# Altium project SJA1105Q_LAN8870_EVB_revA.PrjPcb (part 1 of 2)
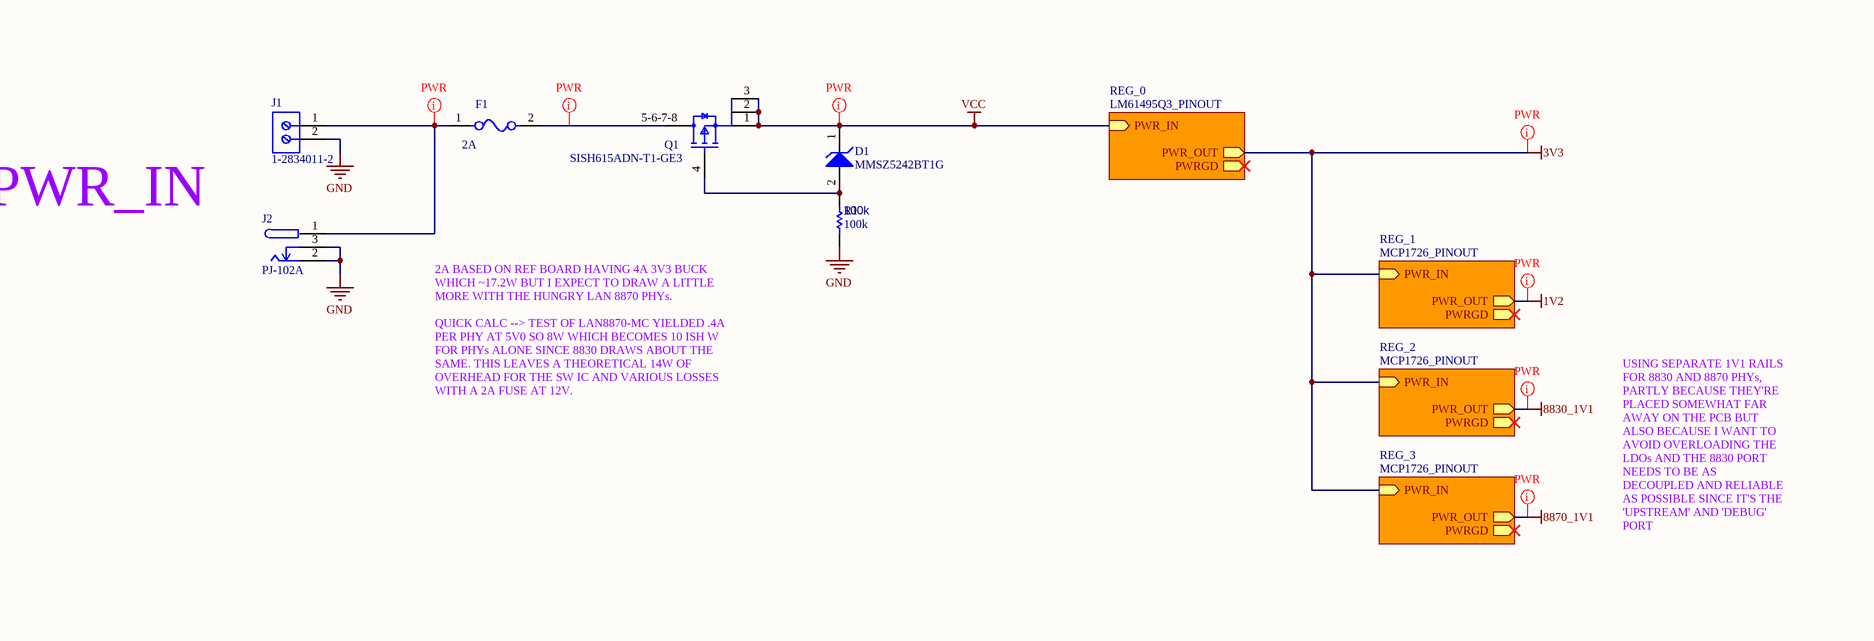
[diagram p0: SJA1105Q_LAN8870_EVB_revA.SchDoc, top left]
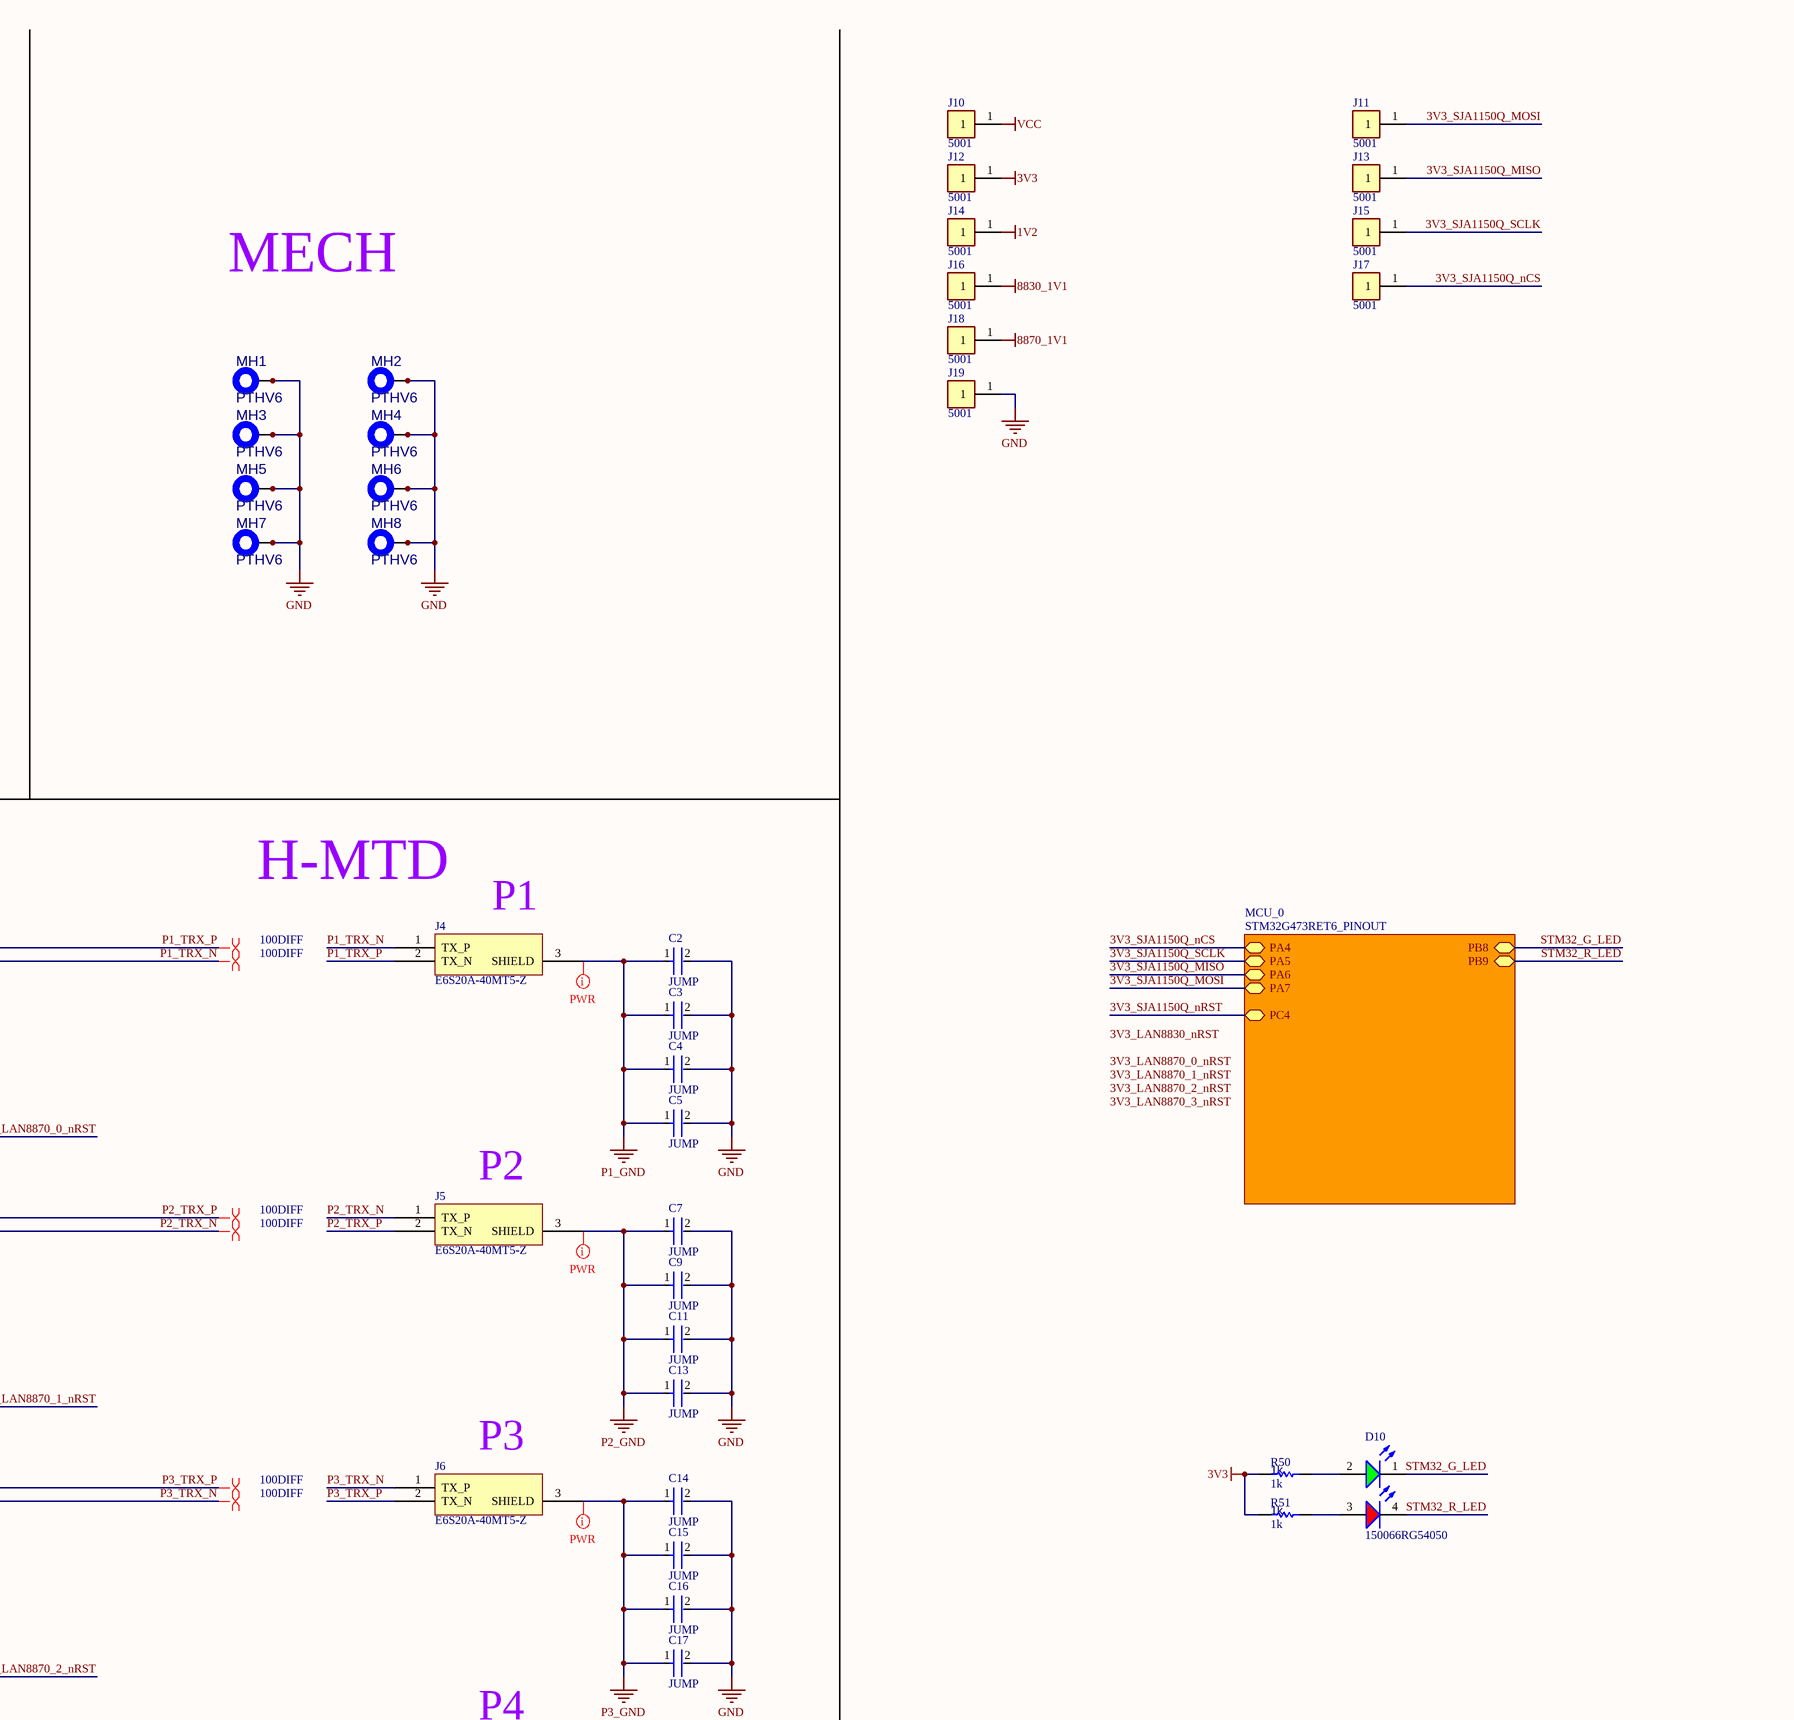
[diagram p1: SJA1105Q_LAN8870_EVB_revA.SchDoc, top right]
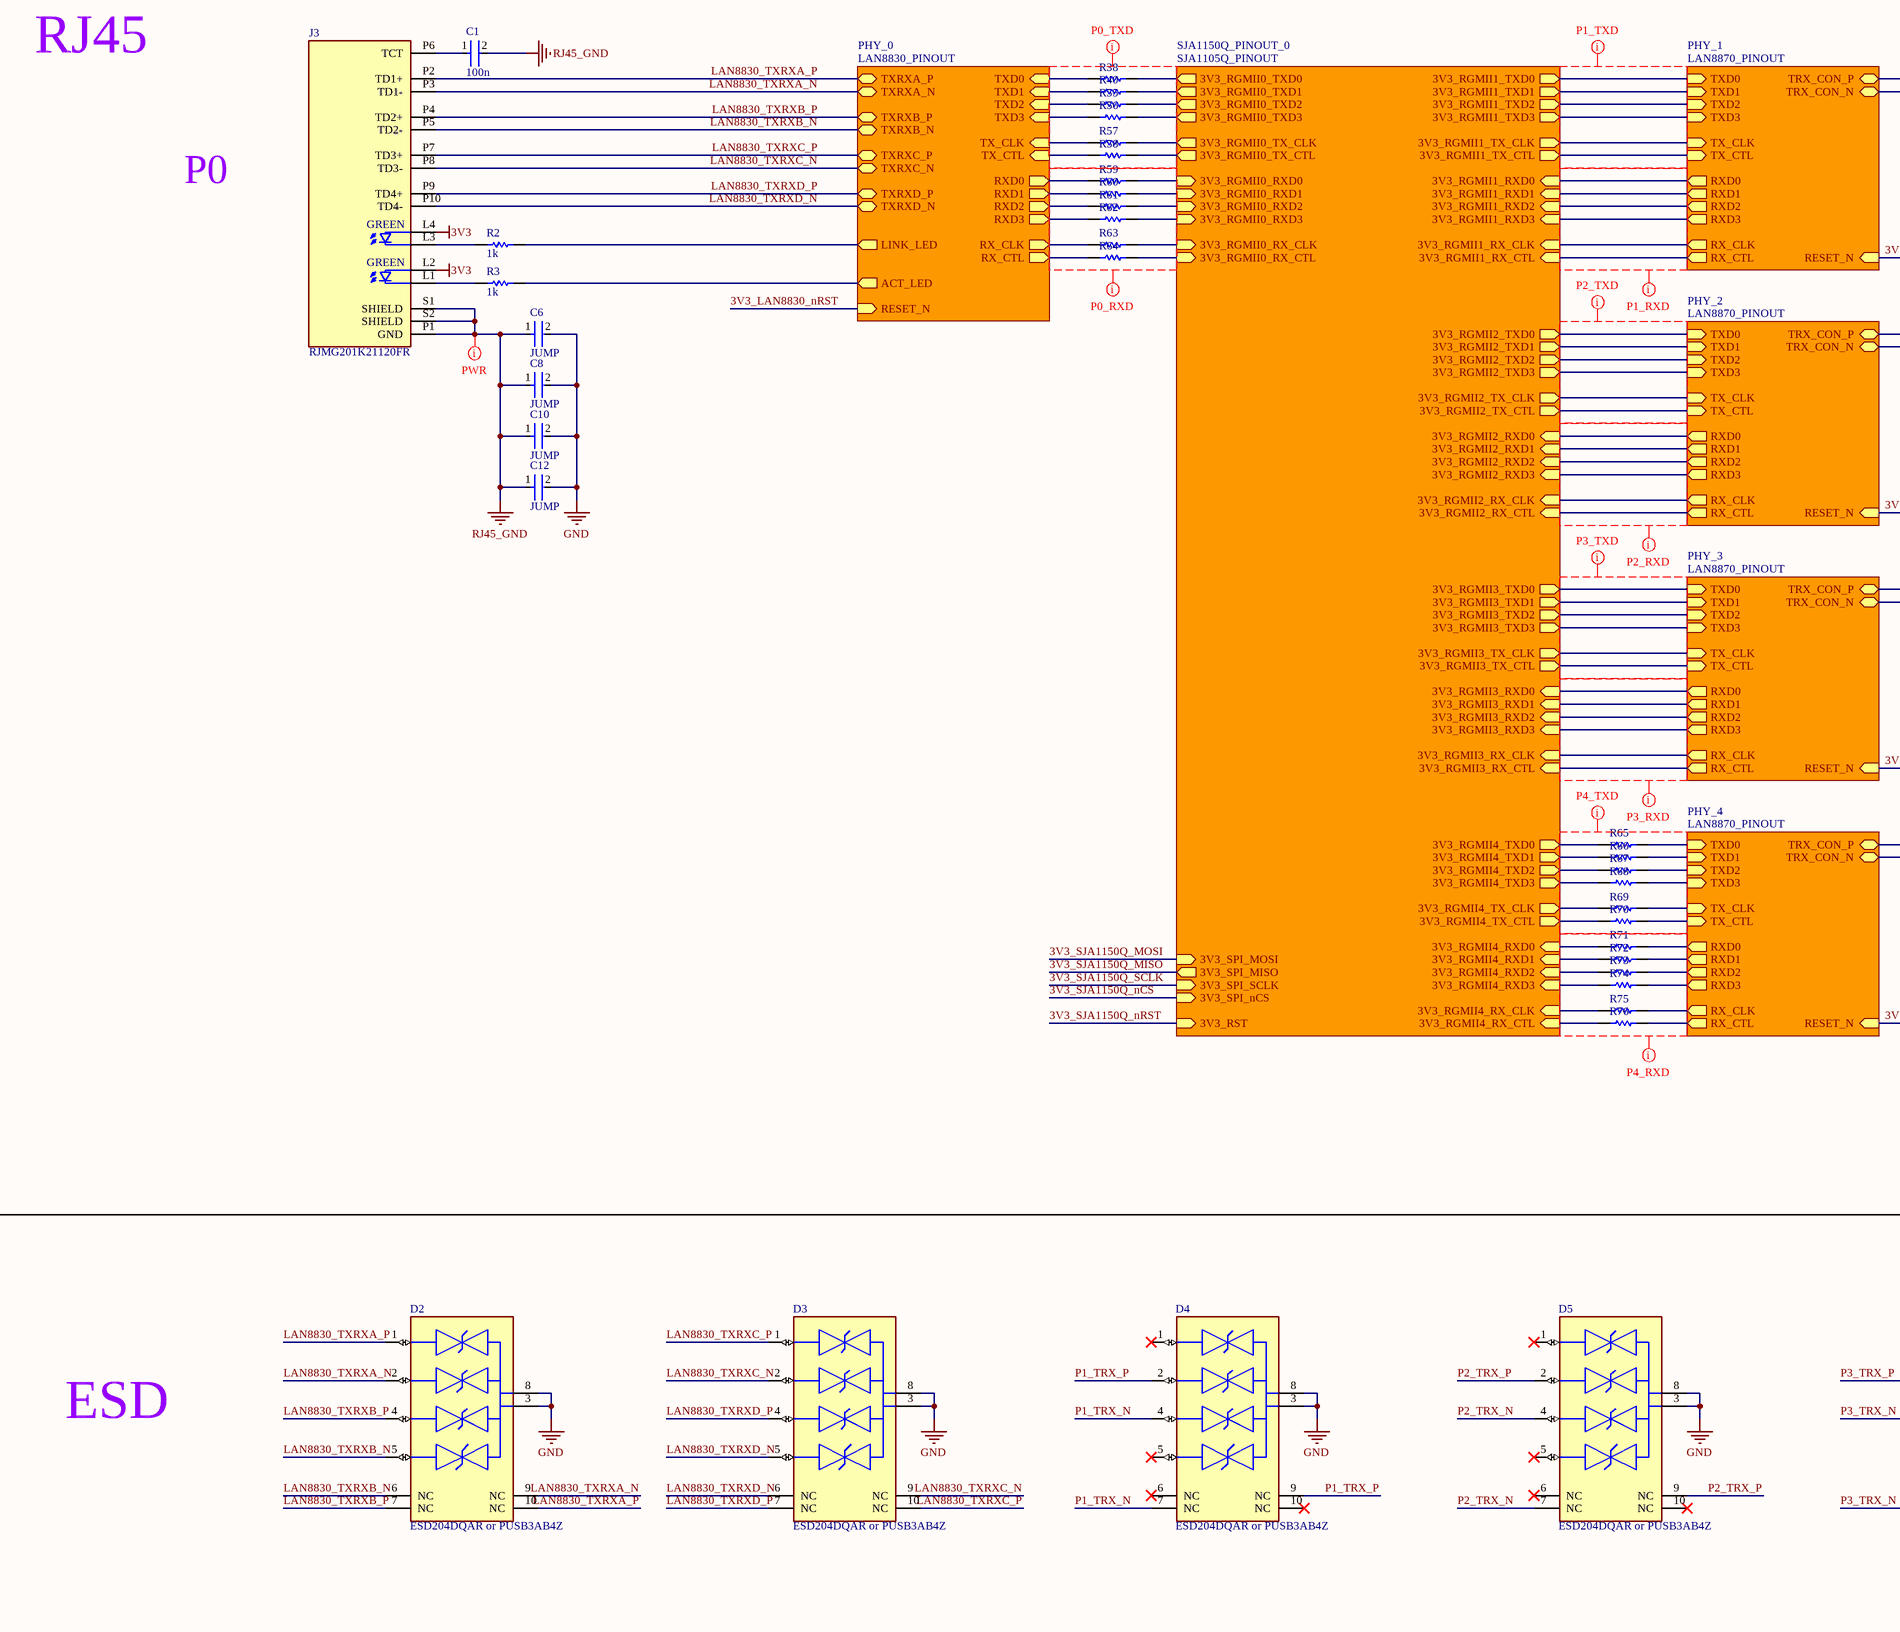
[diagram p2: SJA1105Q_LAN8870_EVB_revA.SchDoc, bottom left]
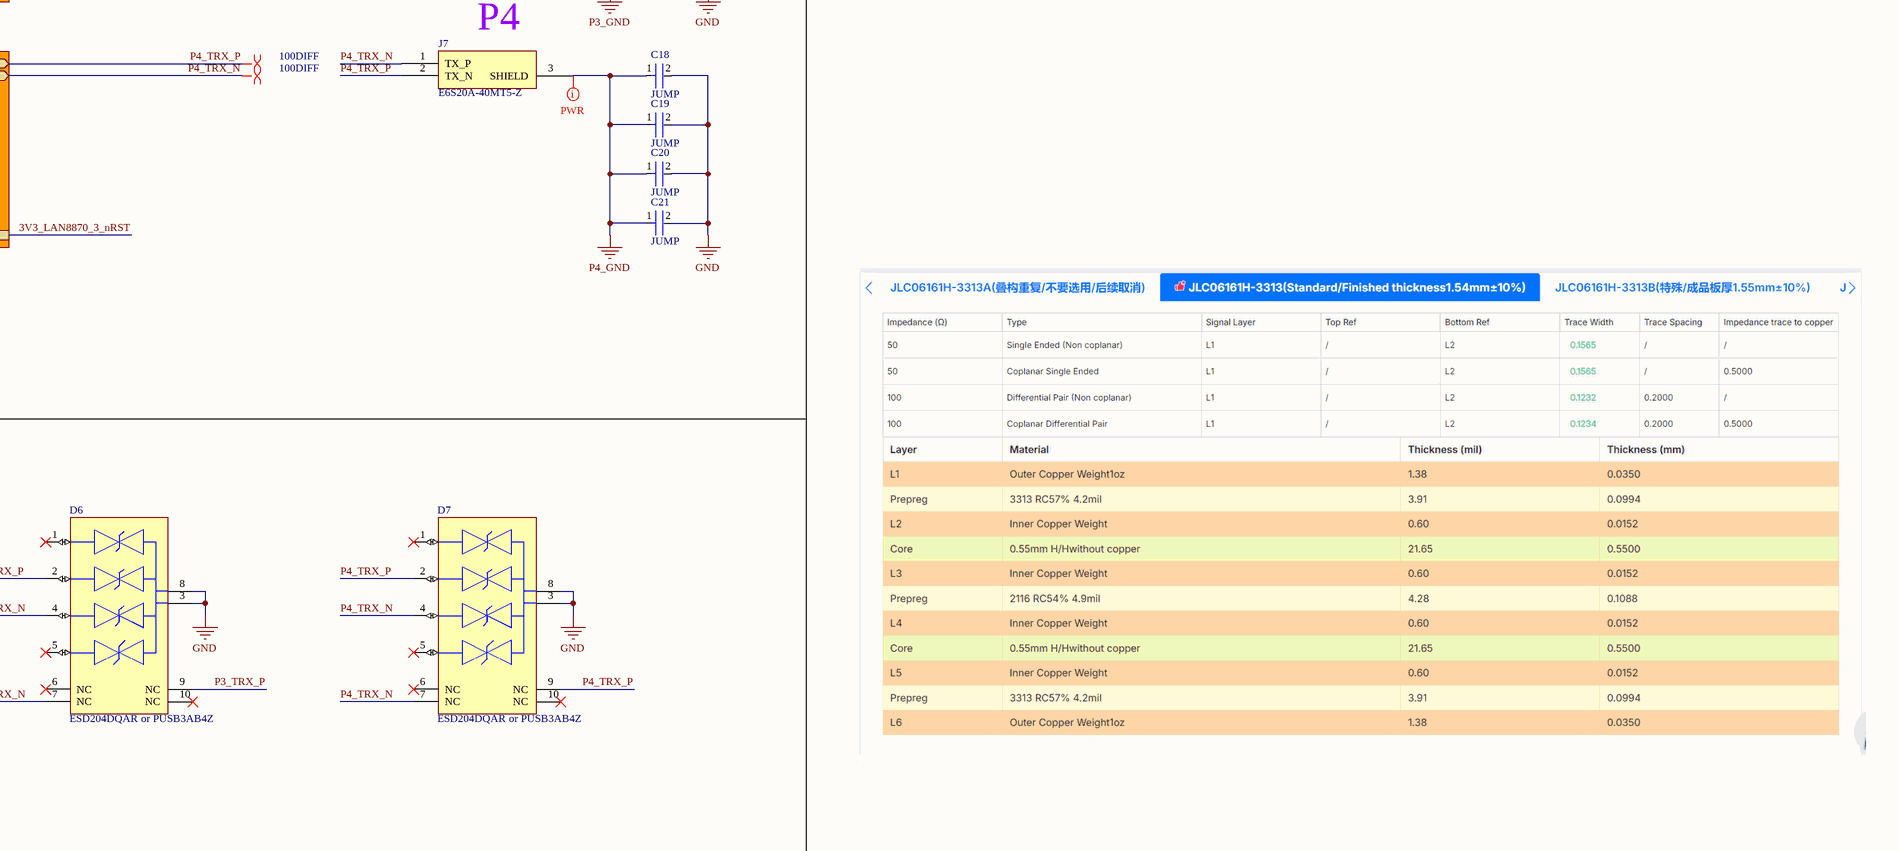
[diagram p3: SJA1105Q_LAN8870_EVB_revA.SchDoc, bottom right]
7 sheets, 490 parts. Net scope: hierarchical (ports join the sheet entries above them; power ports are global).
Board file: SJA1105Q_LAN8870_EVB_revA.PcbDoc
Sheets:
  SJA1105Q_LAN8870_EVB_revA.SchDoc
    SJA1150Q_PINOUT_0 = SJA1105Q_PINOUT.SchDoc
    PHY_1 = LAN8870_PINOUT.SchDoc
    PHY_0 = LAN8830_PINOUT.SchDoc
    PHY_2 = LAN8870_PINOUT.SchDoc
    PHY_3 = LAN8870_PINOUT.SchDoc
    PHY_4 = LAN8870_PINOUT.SchDoc
    REG_0 = LM61495Q3_PINOUT.SchDoc
    REG_1 = MCP1726_PINOUT.SchDoc
    REG_2 = MCP1726_PINOUT.SchDoc
    MCU_0 = STM32G473RET6_PINOUT.SchDoc
    REG_3 = MCP1726_PINOUT.SchDoc

## Sheet SJA1105Q_LAN8870_EVB_revA.SchDoc
size D; SheetNumber: 1; SheetTotal: 7

### Parts
C1  100n  [FP-0402-L_1_0_0_05-W_0_5-IPC_A]
C2  JUMP  [FP-0402-L_1_0_0_05-W_0_5-IPC_A]
C3  JUMP  [FP-0402-L_1_0_0_05-W_0_5-IPC_A]
C4  JUMP  [FP-0402-L_1_0_0_05-W_0_5-IPC_A]
C5  JUMP  [FP-0402-L_1_0_0_05-W_0_5-IPC_A]
C6  JUMP  [FP-0402-L_1_0_0_05-W_0_5-IPC_A]
C7  JUMP  [FP-0402-L_1_0_0_05-W_0_5-IPC_A]
C8  JUMP  [FP-0402-L_1_0_0_05-W_0_5-IPC_A]
C9  JUMP  [FP-0402-L_1_0_0_05-W_0_5-IPC_A]
C10  JUMP  [FP-0402-L_1_0_0_05-W_0_5-IPC_A]
C11  JUMP  [FP-0402-L_1_0_0_05-W_0_5-IPC_A]
C12  JUMP  [FP-0402-L_1_0_0_05-W_0_5-IPC_A]
C13  JUMP  [FP-0402-L_1_0_0_05-W_0_5-IPC_A]
C14  JUMP  [FP-0402-L_1_0_0_05-W_0_5-IPC_A]
C15  JUMP  [FP-0402-L_1_0_0_05-W_0_5-IPC_A]
C16  JUMP  [FP-0402-L_1_0_0_05-W_0_5-IPC_A]
C17  JUMP  [FP-0402-L_1_0_0_05-W_0_5-IPC_A]
C18  JUMP  [FP-0402-L_1_0_0_05-W_0_5-IPC_A]
C19  JUMP  [FP-0402-L_1_0_0_05-W_0_5-IPC_A]
C20  JUMP  [FP-0402-L_1_0_0_05-W_0_5-IPC_A]
C21  JUMP  [FP-0402-L_1_0_0_05-W_0_5-IPC_A]
D1  MMSZ5242BT1G  [ONSC-SOD-123-2-425-04_V]
D2  ESD204DQAR or PUSB3AB4Z  [FP-DQA0010A-MFG]
D3  ESD204DQAR or PUSB3AB4Z  [FP-DQA0010A-MFG]
D4  ESD204DQAR or PUSB3AB4Z  [FP-DQA0010A-MFG]
D5  ESD204DQAR or PUSB3AB4Z  [FP-DQA0010A-MFG]
D6  ESD204DQAR or PUSB3AB4Z  [FP-DQA0010A-MFG]
D7  ESD204DQAR or PUSB3AB4Z  [FP-DQA0010A-MFG]
D10  150066RG54050  [WL-SBCD_0606]
F1  2A  [FP-SF-1206FP-MFG]
J1  1-2834011-2  [1-2834011-2-Footprint-1]
J2  PJ-102A  [FP-PJ-102A-MFG]
J3  RJMG201K21120FR  [RJMG201K21120FR-Footprint-1]
J4  E6S20A-40MT5-Z  [E6S20A-40MT5-Z-Footprint-1]
J5  E6S20A-40MT5-Z  [E6S20A-40MT5-Z-Footprint-1]
J6  E6S20A-40MT5-Z  [E6S20A-40MT5-Z-Footprint-1]
J7  E6S20A-40MT5-Z  [E6S20A-40MT5-Z-Footprint-1]
J10  5001  [FP-5001-MFG]
J11  5001  [FP-5001-MFG]
J12  5001  [FP-5001-MFG]
J13  5001  [FP-5001-MFG]
J14  5001  [FP-5001-MFG]
J15  5001  [FP-5001-MFG]
J16  5001  [FP-5001-MFG]
J17  5001  [FP-5001-MFG]
J18  5001  [FP-5001-MFG]
J19  5001  [FP-5001-MFG]
MH1  PTHV6  [PTHV6 M2]  (net tie, no BOM)
MH2  PTHV6  [PTHV6 M2]  (net tie, no BOM)
MH3  PTHV6  [PTHV6 M2]  (net tie, no BOM)
MH4  PTHV6  [PTHV6 M2]  (net tie, no BOM)
MH5  PTHV6  [PTHV6 M2]  (net tie, no BOM)
MH6  PTHV6  [PTHV6 M2]  (net tie, no BOM)
MH7  PTHV6  [PTHV6 M2]  (net tie, no BOM)
MH8  PTHV6  [PTHV6 M2]  (net tie, no BOM)
Q1  SISH615ADN-T1-GE3  [SISH615ADN-T1-GE3-Footprint-1]
R1  100k  [R0603B]
R2  1k  [R0603B]
R3  1k  [R0603B]
R38  0402 JUMPER  [RESC1005X40X25ML05T05]  (value not drawn)
R40  0402 JUMPER  [RESC1005X40X25ML05T05]  (value not drawn)
R50  1k  [R0603B]
R51  1k  [R0603B]
R55  0402 JUMPER  [RESC1005X40X25ML05T05]  (value not drawn)
R56  0402 JUMPER  [RESC1005X40X25ML05T05]  (value not drawn)
R57  0402 JUMPER  [RESC1005X40X25ML05T05]  (value not drawn)
R58  0402 JUMPER  [RESC1005X40X25ML05T05]  (value not drawn)
R59  0402 JUMPER  [RESC1005X40X25ML05T05]  (value not drawn)
R60  0402 JUMPER  [RESC1005X40X25ML05T05]  (value not drawn)
R61  0402 JUMPER  [RESC1005X40X25ML05T05]  (value not drawn)
R62  0402 JUMPER  [RESC1005X40X25ML05T05]  (value not drawn)
R63  0402 JUMPER  [RESC1005X40X25ML05T05]  (value not drawn)
R64  0402 JUMPER  [RESC1005X40X25ML05T05]  (value not drawn)
R65  0402 JUMPER  [RESC1005X40X25ML05T05]  (value not drawn)
R66  0402 JUMPER  [RESC1005X40X25ML05T05]  (value not drawn)
R67  0402 JUMPER  [RESC1005X40X25ML05T05]  (value not drawn)
R68  0402 JUMPER  [RESC1005X40X25ML05T05]  (value not drawn)
R69  0402 JUMPER  [RESC1005X40X25ML05T05]  (value not drawn)
R70  0402 JUMPER  [RESC1005X40X25ML05T05]  (value not drawn)
R71  0402 JUMPER  [RESC1005X40X25ML05T05]  (value not drawn)
R72  0402 JUMPER  [RESC1005X40X25ML05T05]  (value not drawn)
R73  0402 JUMPER  [RESC1005X40X25ML05T05]  (value not drawn)
R74  0402 JUMPER  [RESC1005X40X25ML05T05]  (value not drawn)
R75  0402 JUMPER  [RESC1005X40X25ML05T05]  (value not drawn)
R76  0402 JUMPER  [RESC1005X40X25ML05T05]  (value not drawn)

### Sub-sheets
MCU_0 = STM32G473RET6_PINOUT: PA5 (bidir), PA6 (bidir), PA7 (bidir), PA4 (bidir), PC4 (bidir), PB9 (bidir), PB8 (bidir)
PHY_0 = LAN8830_PINOUT: TXD0 (in), TXD1 (in), TXD2 (in), TXD3 (in), TX_CTL (in), RXD0 (out), RXD1 (out), RXD2 (out), RXD3 (out), RX_CTL (out), TXRXA_P (bidir), TXRXA_N (bidir), ACT_LED (out), LINK_LED (out), RESET_N (in), TXRXB_P (bidir), TXRXB_N (bidir), TXRXC_P (bidir), TXRXC_N (bidir), TXRXD_P (bidir), TXRXD_N (bidir), TX_CLK (in), RX_CLK (out)
PHY_1 = LAN8870_PINOUT: TRX_CON_P (bidir), TRX_CON_N (bidir), RESET_N (in), TXD0 (in), TXD1 (in), TXD2 (in), TXD3 (in), TX_CTL (in), RXD0 (out), RXD1 (out), RXD2 (out), RXD3 (out), RX_CTL (out), TX_CLK (in), RX_CLK (out)
PHY_2 = LAN8870_PINOUT: TRX_CON_P (bidir), TRX_CON_N (bidir), RESET_N (in), TXD0 (in), TXD1 (in), TXD2 (in), TXD3 (in), TX_CTL (in), RXD0 (out), RXD1 (out), RXD2 (out), RXD3 (out), RX_CTL (out), TX_CLK (in), RX_CLK (out)
PHY_3 = LAN8870_PINOUT: TRX_CON_P (bidir), TRX_CON_N (bidir), RESET_N (in), TXD0 (in), TXD1 (in), TXD2 (in), TXD3 (in), TX_CTL (in), RXD0 (out), RXD1 (out), RXD2 (out), RXD3 (out), RX_CTL (out), TX_CLK (in), RX_CLK (out)
PHY_4 = LAN8870_PINOUT: TRX_CON_P (bidir), TRX_CON_N (bidir), RESET_N (in), TXD0 (in), TXD1 (in), TXD2 (in), TXD3 (in), TX_CTL (in), RXD0 (out), RXD1 (out), RXD2 (out), RXD3 (out), RX_CTL (out), TX_CLK (in), RX_CLK (out)
REG_0 = LM61495Q3_PINOUT: PWR_IN (in), PWR_OUT (out), PWRGD (out)
REG_1 = MCP1726_PINOUT: PWR_OUT (out), PWR_IN (in), PWRGD (out)
REG_2 = MCP1726_PINOUT: PWR_OUT (out), PWR_IN (in), PWRGD (out)
REG_3 = MCP1726_PINOUT: PWR_OUT (out), PWR_IN (in), PWRGD (out)
SJA1150Q_PINOUT_0 = SJA1105Q_PINOUT: 3V3_RGMII0_TXD0 (out), 3V3_RGMII0_TXD1 (out), 3V3_RGMII0_TXD2 (out), 3V3_RGMII0_TXD3 (out), 3V3_RGMII0_TX_CLK (out), 3V3_RGMII0_TX_CTL (out), 3V3_RGMII0_RXD0 (in), 3V3_RGMII0_RXD1 (in), 3V3_RGMII0_RXD2 (in), 3V3_RGMII0_RXD3 (in), 3V3_RGMII0_RX_CLK (in), 3V3_RGMII0_RX_CTL (in), 3V3_RGMII1_TXD0 (out), 3V3_RGMII1_TXD1 (out), 3V3_RGMII1_TXD2 (out), 3V3_RGMII1_TXD3 (out), 3V3_RGMII1_TX_CLK (out), 3V3_RGMII1_TX_CTL (out), 3V3_RGMII1_RXD0 (in), 3V3_RGMII1_RXD1 (in), 3V3_RGMII1_RXD2 (in), 3V3_RGMII1_RXD3 (in), 3V3_RGMII1_RX_CLK (in), 3V3_RGMII1_RX_CTL (in), 3V3_RGMII2_TXD0 (out), 3V3_RGMII2_TXD1 (out), 3V3_RGMII2_TXD2 (out), 3V3_RGMII2_TXD3 (out), 3V3_RGMII2_TX_CLK (out), 3V3_RGMII2_TX_CTL (out), 3V3_RGMII2_RXD0 (in), 3V3_RGMII2_RXD1 (in), 3V3_RGMII2_RXD2 (in), 3V3_RGMII2_RXD3 (in), 3V3_RGMII2_RX_CLK (in), 3V3_RGMII2_RX_CTL (in), 3V3_RGMII3_TXD0 (out), 3V3_RGMII3_TXD1 (out), 3V3_RGMII3_TXD2 (out), 3V3_RGMII3_TXD3 (out), 3V3_RGMII3_TX_CLK (out), 3V3_RGMII3_TX_CTL (out), 3V3_RGMII3_RXD0 (in), 3V3_RGMII3_RXD1 (in), 3V3_RGMII3_RXD2 (in), 3V3_RGMII3_RXD3 (in), 3V3_RGMII3_RX_CLK (in), 3V3_RGMII3_RX_CTL (in), 3V3_RGMII4_TXD0 (out), 3V3_RGMII4_TXD1 (out), 3V3_RGMII4_TXD2 (out), 3V3_RGMII4_TXD3 (out), 3V3_RGMII4_TX_CLK (out), 3V3_RGMII4_TX_CTL (out), 3V3_RGMII4_RXD0 (in), 3V3_RGMII4_RXD1 (in), 3V3_RGMII4_RXD2 (in), 3V3_RGMII4_RXD3 (in), 3V3_RGMII4_RX_CLK (in), 3V3_RGMII4_RX_CTL (in), 3V3_RST (in), 3V3_SPI_MOSI (in), 3V3_SPI_MISO (out), 3V3_SPI_SCLK (in), 3V3_SPI_nCS (in)

### Nets
1V2: J14.1 ; sheet REG_1/PWR_OUT
3V3: J3.L2 J3.L4 J12.1 R50.2 R51.2 ; sheet REG_0/PWR_OUT, sheet REG_1/PWR_IN, sheet REG_2/PWR_IN, sheet REG_3/PWR_IN
8830_1V1: J16.1 ; sheet REG_2/PWR_OUT
8870_1V1: J18.1 ; sheet REG_3/PWR_OUT
GND: C2.2 C3.2 C4.2 C5.2 C6.2 C7.2 C8.2 C9.2 C10.2 C11.2 C12.2 C13.2 C14.2 C15.2 C16.2 C17.2 C18.2 C19.2 C20.2 C21.2 D2.3(GND) D2.8(GND) D3.3(GND) D3.8(GND) D4.3(GND) D4.8(GND) D5.3(GND) D5.8(GND) D6.3(GND) D6.8(GND) D7.3(GND) D7.8(GND) J1.2 J2.2 J2.3 J19.1 MH1.1(MH) MH1.2(V1) MH1.3(V2) MH1.4(V3) MH1.5(V4) MH1.6(V5) MH1.7(V6) MH2.1(MH) MH2.2(V1) MH2.3(V2) MH2.4(V3) MH2.5(V4) MH2.6(V5) MH2.7(V6) MH3.1(MH) MH3.2(V1) MH3.3(V2) MH3.4(V3) MH3.5(V4) MH3.6(V5) MH3.7(V6) MH4.1(MH) MH4.2(V1) MH4.3(V2) MH4.4(V3) MH4.5(V4) MH4.6(V5) MH4.7(V6) MH5.1(MH) MH5.2(V1) MH5.3(V2) MH5.4(V3) MH5.5(V4) MH5.6(V5) MH5.7(V6) MH6.1(MH) MH6.2(V1) MH6.3(V2) MH6.4(V3) MH6.5(V4) MH6.6(V5) MH6.7(V6) MH7.1(MH) MH7.2(V1) MH7.3(V2) MH7.4(V3) MH7.5(V4) MH7.6(V5) MH7.7(V6) MH8.1(MH) MH8.2(V1) MH8.3(V2) MH8.4(V3) MH8.5(V4) MH8.6(V5) MH8.7(V6) R1.1
P1_GND: C2.1 C3.1 C4.1 C5.1 J4.3(SHIELD)
P2_GND: C7.1 C9.1 C11.1 C13.1 J5.3(SHIELD)
P3_GND: C14.1 C15.1 C16.1 C17.1 J6.3(SHIELD)
P4_GND: C18.1 C19.1 C20.1 C21.1 J7.3(SHIELD)
RJ45_GND: C1.2 C6.1 C8.1 C10.1 C12.1 J3.P1(GND) J3.S1(SHIELD) J3.S2(SHIELD)
VCC: D1.1(K) J10.1 Q1.1(S) Q1.2(S) Q1.3(S) ; sheet REG_0/PWR_IN
3V3_SJA1150Q_MISO: J13.1 ; sheet SJA1150Q_PINOUT_0/3V3_SPI_MISO, sheet MCU_0/PA6
3V3_SJA1150Q_MOSI: J11.1 ; sheet SJA1150Q_PINOUT_0/3V3_SPI_MOSI, sheet MCU_0/PA7
3V3_SJA1150Q_nCS: J17.1 ; sheet SJA1150Q_PINOUT_0/3V3_SPI_nCS, sheet MCU_0/PA4
3V3_SJA1150Q_nRST: sheet SJA1150Q_PINOUT_0/3V3_RST, sheet MCU_0/PC4
3V3_SJA1150Q_SCLK: J15.1 ; sheet SJA1150Q_PINOUT_0/3V3_SPI_SCLK, sheet MCU_0/PA5
LAN8830_CLK125_EN: R64.1 ; sheet PHY_0/RX_CTL
LAN8830_MODE0: R59.1 ; sheet PHY_0/RXD0
LAN8830_MODE1: R60.1 ; sheet PHY_0/RXD1
LAN8830_MODE2: R61.1 ; sheet PHY_0/RXD2
LAN8830_MODE3: R62.1 ; sheet PHY_0/RXD3
LAN8830_MODE4: R63.1 ; sheet PHY_0/RX_CLK
LAN8830_PHYAD0: R3.1 ; sheet PHY_0/ACT_LED
LAN8830_PHYAD1: R2.1 ; sheet PHY_0/LINK_LED
LAN8830_TXRXA_N: D2.2(IO2) D2.9(NC) J3.P3(TD1-) ; sheet PHY_0/TXRXA_N
LAN8830_TXRXA_P: D2.1(IO1) D2.10(NC) J3.P2(TD1+) ; sheet PHY_0/TXRXA_P
LAN8830_TXRXB_N: D2.5(IO4) D2.6(NC) J3.P5(TD2-) ; sheet PHY_0/TXRXB_N
LAN8830_TXRXB_P: D2.4(IO3) D2.7(NC) J3.P4(TD2+) ; sheet PHY_0/TXRXB_P
LAN8830_TXRXC_N: D3.2(IO2) D3.9(NC) J3.P8(TD3-) ; sheet PHY_0/TXRXC_N
LAN8830_TXRXC_P: D3.1(IO1) D3.10(NC) J3.P7(TD3+) ; sheet PHY_0/TXRXC_P
LAN8830_TXRXD_N: D3.5(IO4) D3.6(NC) J3.P10(TD4-) ; sheet PHY_0/TXRXD_N
LAN8830_TXRXD_P: D3.4(IO3) D3.7(NC) J3.P9(TD4+) ; sheet PHY_0/TXRXD_P
LAN8870_RX_CLK: R75.2 ; sheet PHY_4/RX_CLK
LAN8870_RX_CLK: sheet SJA1150Q_PINOUT_0/3V3_RGMII1_RX_CLK, sheet PHY_1/RX_CLK  [a separate net that carries the same name]
LAN8870_RX_CLK: sheet SJA1150Q_PINOUT_0/3V3_RGMII2_RX_CLK, sheet PHY_2/RX_CLK  [a separate net that carries the same name]
LAN8870_RX_CLK: sheet SJA1150Q_PINOUT_0/3V3_RGMII3_RX_CLK, sheet PHY_3/RX_CLK  [a separate net that carries the same name]
LAN8870_RXCTL: R76.2 ; sheet PHY_4/RX_CTL
LAN8870_RXCTL: sheet SJA1150Q_PINOUT_0/3V3_RGMII1_RX_CTL, sheet PHY_1/RX_CTL  [a separate net that carries the same name]
LAN8870_RXCTL: sheet SJA1150Q_PINOUT_0/3V3_RGMII2_RX_CTL, sheet PHY_2/RX_CTL  [a separate net that carries the same name]
LAN8870_RXCTL: sheet SJA1150Q_PINOUT_0/3V3_RGMII3_RX_CTL, sheet PHY_3/RX_CTL  [a separate net that carries the same name]
LAN8870_RXD0: R71.2 ; sheet PHY_4/RXD0
LAN8870_RXD0: sheet SJA1150Q_PINOUT_0/3V3_RGMII1_RXD0, sheet PHY_1/RXD0  [a separate net that carries the same name]
LAN8870_RXD0: sheet SJA1150Q_PINOUT_0/3V3_RGMII2_RXD0, sheet PHY_2/RXD0  [a separate net that carries the same name]
LAN8870_RXD0: sheet SJA1150Q_PINOUT_0/3V3_RGMII3_RXD0, sheet PHY_3/RXD0  [a separate net that carries the same name]
LAN8870_RXD1: R72.2 ; sheet PHY_4/RXD1
LAN8870_RXD1: sheet SJA1150Q_PINOUT_0/3V3_RGMII1_RXD1, sheet PHY_1/RXD1  [a separate net that carries the same name]
LAN8870_RXD1: sheet SJA1150Q_PINOUT_0/3V3_RGMII2_RXD1, sheet PHY_2/RXD1  [a separate net that carries the same name]
LAN8870_RXD1: sheet SJA1150Q_PINOUT_0/3V3_RGMII3_RXD1, sheet PHY_3/RXD1  [a separate net that carries the same name]
LAN8870_RXD2: R73.2 ; sheet PHY_4/RXD2
LAN8870_RXD2: sheet SJA1150Q_PINOUT_0/3V3_RGMII1_RXD2, sheet PHY_1/RXD2  [a separate net that carries the same name]
LAN8870_RXD2: sheet SJA1150Q_PINOUT_0/3V3_RGMII2_RXD2, sheet PHY_2/RXD2  [a separate net that carries the same name]
LAN8870_RXD2: sheet SJA1150Q_PINOUT_0/3V3_RGMII3_RXD2, sheet PHY_3/RXD2  [a separate net that carries the same name]
LAN8870_RXD3: R74.2 ; sheet PHY_4/RXD3
LAN8870_RXD3: sheet SJA1150Q_PINOUT_0/3V3_RGMII1_RXD3, sheet PHY_1/RXD3  [a separate net that carries the same name]
LAN8870_RXD3: sheet SJA1150Q_PINOUT_0/3V3_RGMII2_RXD3, sheet PHY_2/RXD3  [a separate net that carries the same name]
LAN8870_RXD3: sheet SJA1150Q_PINOUT_0/3V3_RGMII3_RXD3, sheet PHY_3/RXD3  [a separate net that carries the same name]
LAN8870_TX_CLK: R69.2 ; sheet PHY_4/TX_CLK
LAN8870_TX_CLK: sheet SJA1150Q_PINOUT_0/3V3_RGMII1_TX_CLK, sheet PHY_1/TX_CLK  [a separate net that carries the same name]
LAN8870_TX_CLK: sheet SJA1150Q_PINOUT_0/3V3_RGMII2_TX_CLK, sheet PHY_2/TX_CLK  [a separate net that carries the same name]
LAN8870_TX_CLK: sheet SJA1150Q_PINOUT_0/3V3_RGMII3_TX_CLK, sheet PHY_3/TX_CLK  [a separate net that carries the same name]
LAN8870_TX_CTL: R70.2 ; sheet PHY_4/TX_CTL
LAN8870_TX_CTL: sheet SJA1150Q_PINOUT_0/3V3_RGMII1_TX_CTL, sheet PHY_1/TX_CTL  [a separate net that carries the same name]
LAN8870_TX_CTL: sheet SJA1150Q_PINOUT_0/3V3_RGMII2_TX_CTL, sheet PHY_2/TX_CTL  [a separate net that carries the same name]
LAN8870_TX_CTL: sheet SJA1150Q_PINOUT_0/3V3_RGMII3_TX_CTL, sheet PHY_3/TX_CTL  [a separate net that carries the same name]
LAN8870_TXD0: R65.2 ; sheet PHY_4/TXD0
LAN8870_TXD0: sheet SJA1150Q_PINOUT_0/3V3_RGMII1_TXD0, sheet PHY_1/TXD0  [a separate net that carries the same name]
LAN8870_TXD0: sheet SJA1150Q_PINOUT_0/3V3_RGMII2_TXD0, sheet PHY_2/TXD0  [a separate net that carries the same name]
LAN8870_TXD0: sheet SJA1150Q_PINOUT_0/3V3_RGMII3_TXD0, sheet PHY_3/TXD0  [a separate net that carries the same name]
LAN8870_TXD1: R66.2 ; sheet PHY_4/TXD1
LAN8870_TXD1: sheet SJA1150Q_PINOUT_0/3V3_RGMII1_TXD1, sheet PHY_1/TXD1  [a separate net that carries the same name]
LAN8870_TXD1: sheet SJA1150Q_PINOUT_0/3V3_RGMII2_TXD1, sheet PHY_2/TXD1  [a separate net that carries the same name]
LAN8870_TXD1: sheet SJA1150Q_PINOUT_0/3V3_RGMII3_TXD1, sheet PHY_3/TXD1  [a separate net that carries the same name]
LAN8870_TXD2: R67.2 ; sheet PHY_4/TXD2
LAN8870_TXD2: sheet SJA1150Q_PINOUT_0/3V3_RGMII1_TXD2, sheet PHY_1/TXD2  [a separate net that carries the same name]
LAN8870_TXD2: sheet SJA1150Q_PINOUT_0/3V3_RGMII2_TXD2, sheet PHY_2/TXD2  [a separate net that carries the same name]
LAN8870_TXD2: sheet SJA1150Q_PINOUT_0/3V3_RGMII3_TXD2, sheet PHY_3/TXD2  [a separate net that carries the same name]
LAN8870_TXD3: R68.2 ; sheet PHY_4/TXD3
LAN8870_TXD3: sheet SJA1150Q_PINOUT_0/3V3_RGMII1_TXD3, sheet PHY_1/TXD3  [a separate net that carries the same name]
LAN8870_TXD3: sheet SJA1150Q_PINOUT_0/3V3_RGMII2_TXD3, sheet PHY_2/TXD3  [a separate net that carries the same name]
LAN8870_TXD3: sheet SJA1150Q_PINOUT_0/3V3_RGMII3_TXD3, sheet PHY_3/TXD3  [a separate net that carries the same name]
P1_TRX_N: D4.4(IO3) D4.7(NC) J4.1(TX_P) ; sheet PHY_1/TRX_CON_N
P1_TRX_P: D4.2(IO2) D4.9(NC) J4.2(TX_N) ; sheet PHY_1/TRX_CON_P
P2_TRX_N: D5.4(IO3) D5.7(NC) J5.1(TX_P) ; sheet PHY_2/TRX_CON_N
P2_TRX_P: D5.2(IO2) D5.9(NC) J5.2(TX_N) ; sheet PHY_2/TRX_CON_P
P3_TRX_N: D6.4(IO3) D6.7(NC) J6.1(TX_P) ; sheet PHY_3/TRX_CON_N
P3_TRX_P: D6.2(IO2) D6.9(NC) J6.2(TX_N) ; sheet PHY_3/TRX_CON_P
P4_TRX_N: D7.4(IO3) D7.7(NC) J7.1(TX_P) ; sheet PHY_4/TRX_CON_N
P4_TRX_P: D7.2(IO2) D7.9(NC) J7.2(TX_N) ; sheet PHY_4/TRX_CON_P
STM32_G_LED: D10.1(K) ; sheet MCU_0/PB8
STM32_R_LED: D10.4(K) ; sheet MCU_0/PB9
NetC1_1: C1.1 J3.P6(TCT)
NetD1_2: D1.2(A) Q1.4(G) R1.2
NetD10_2: D10.2(A) R50.1
NetD10_3: D10.3(A) R51.1
NetF1_1: F1.1 J1.1 J2.1
NetF1_2: F1.2 Q1.5-6-7-8(D)
NetJ3_L1: J3.L1 R3.2
NetJ3_L3: J3.L3 R2.2
NetR38_1: R38.1 ; sheet PHY_0/TXD0
NetR38_2: R38.2 ; sheet SJA1150Q_PINOUT_0/3V3_RGMII0_TXD0
NetR40_1: R40.1 ; sheet PHY_0/TXD1
NetR40_2: R40.2 ; sheet SJA1150Q_PINOUT_0/3V3_RGMII0_TXD1
NetR55_1: R55.1 ; sheet PHY_0/TXD2
NetR55_2: R55.2 ; sheet SJA1150Q_PINOUT_0/3V3_RGMII0_TXD2
NetR56_1: R56.1 ; sheet PHY_0/TXD3
NetR56_2: R56.2 ; sheet SJA1150Q_PINOUT_0/3V3_RGMII0_TXD3
NetR57_1: R57.1 ; sheet PHY_0/TX_CLK
NetR57_2: R57.2 ; sheet SJA1150Q_PINOUT_0/3V3_RGMII0_TX_CLK
NetR58_1: R58.1 ; sheet PHY_0/TX_CTL
NetR58_2: R58.2 ; sheet SJA1150Q_PINOUT_0/3V3_RGMII0_TX_CTL
NetR59_2: R59.2 ; sheet SJA1150Q_PINOUT_0/3V3_RGMII0_RXD0
NetR60_2: R60.2 ; sheet SJA1150Q_PINOUT_0/3V3_RGMII0_RXD1
NetR61_2: R61.2 ; sheet SJA1150Q_PINOUT_0/3V3_RGMII0_RXD2
NetR62_2: R62.2 ; sheet SJA1150Q_PINOUT_0/3V3_RGMII0_RXD3
NetR63_2: R63.2 ; sheet SJA1150Q_PINOUT_0/3V3_RGMII0_RX_CLK
NetR64_2: R64.2 ; sheet SJA1150Q_PINOUT_0/3V3_RGMII0_RX_CTL
NetR65_1: R65.1 ; sheet SJA1150Q_PINOUT_0/3V3_RGMII4_TXD0
NetR66_1: R66.1 ; sheet SJA1150Q_PINOUT_0/3V3_RGMII4_TXD1
NetR67_1: R67.1 ; sheet SJA1150Q_PINOUT_0/3V3_RGMII4_TXD2
NetR68_1: R68.1 ; sheet SJA1150Q_PINOUT_0/3V3_RGMII4_TXD3
NetR69_1: R69.1 ; sheet SJA1150Q_PINOUT_0/3V3_RGMII4_TX_CLK
NetR70_1: R70.1 ; sheet SJA1150Q_PINOUT_0/3V3_RGMII4_TX_CTL
NetR71_1: R71.1 ; sheet SJA1150Q_PINOUT_0/3V3_RGMII4_RXD0
NetR72_1: R72.1 ; sheet SJA1150Q_PINOUT_0/3V3_RGMII4_RXD1
NetR73_1: R73.1 ; sheet SJA1150Q_PINOUT_0/3V3_RGMII4_RXD2
NetR74_1: R74.1 ; sheet SJA1150Q_PINOUT_0/3V3_RGMII4_RXD3
NetR75_1: R75.1 ; sheet SJA1150Q_PINOUT_0/3V3_RGMII4_RX_CLK
NetR76_1: R76.1 ; sheet SJA1150Q_PINOUT_0/3V3_RGMII4_RX_CTL

Not connected (* = marked no-connect by the designer): D4 1(IO1)* 5(IO4)* 6(NC)* 10(NC)*; D5 1(IO1)* 5(IO4)* 6(NC)* 10(NC)*; D6 1(IO1)* 5(IO4)* 6(NC)* 10(NC)*; D7 1(IO1)* 5(IO4)* 6(NC)* 10(NC)*

### Layout directives
net class PWR: 1V2, 3V3, 8830_1V1, 8870_1V1, NetF1_1, NetF1_2, P1_GND, P2_GND, P3_GND, P4_GND, RJ45_GND, VCC
differential pair; differential pair class 100DIFF: P1_TRX_N, P1_TRX_P, P2_TRX_N, P2_TRX_P, P3_TRX_N, P3_TRX_P, P4_TRX_N, P4_TRX_P
net class P0_TXD: (no net found under the mark)
net class P0_RXD: (no net found under the mark)
net class P1_TXD: (no net found under the mark)
net class P1_RXD: (no net found under the mark)
net class P2_TXD: (no net found under the mark)
net class P2_RXD: (no net found under the mark)
net class P3_TXD: (no net found under the mark)
net class P3_RXD: (no net found under the mark)
net class P4_TXD: (no net found under the mark)
net class P4_RXD: (no net found under the mark)

### Notes on the sheet
- MECH
- PWR_IN
- 2A BASED ON REF BOARD HAVING 4A 3V3 BUCK WHICH ~17.2W BUT I EXPECT TO DRAW A LITTLE MORE WITH THE HUNGRY LAN 8870 PHYs.
  QUICK CALC --> TEST OF LAN8870-MC YIELDED .4A PER PHY AT 5V0 SO 8W WHICH BECOMES 10 ISH W FOR PHYs ALONE SINCE 8830 DRAWS ABOUT THE SAME. THIS LEAVES A THEORETICAL 14W OF OVERHEAD FOR THE SW IC AND VARIOUS LOSSES WITH A 2A FUSE AT 12V.
- USING SEPARATE 1V1 RAILS FOR 8830 AND 8870 PHYs, PARTLY BECAUSE THEY'RE PLACED SOMEWHAT FAR AWAY ON THE PCB BUT ALSO BECAUSE I WANT TO AVOID OVERLOADING THE LDOs AND THE 8830 PORT NEEDS TO BE AS DECOUPLED AND RELIABLE AS POSSIBLE SINCE IT'S THE 'UPSTREAM' AND 'DEBUG' PORT
- H-MTD
- RJ45
- (near J4) P1
- P0
- (near J5) P2
- (near J6) P3
- (near J7) P4
- ESD
- Labels drawn without touching a wire or pin: 3V3_LAN8830_nRST, 3V3_LAN8870_0_nRST, 3V3_LAN8870_1_nRST, 3V3_LAN8870_2_nRST, 3V3_LAN8870_3_nRST
- (in symbol CMP-002-00090-1) GREEN

### Library data of the parts
C1-C21 = CMP-001-00058-1: LARGE PADS, 0402 CAP, CHANGE COMMENT TO MATCH REAL P/N; Capacitor Type: Ceramic; Min Operating Temperature: -55°C; Mounting Technology: Surface Mount; Pins: 2; Case/Package: 0402; RoHS Compliant: Yes; Max Operating Temperature: 85°C
D1 = CMP-1060-00565-1: Zener Voltage Regulator, 500 mW, 2-Pin SOD-123, Pb-Free, Tape and Reel; Manufacturer: On Semiconductor; P Max (W): 0.5; VZ Typ (V): 12; PartNumber: MMSZ5242BT1G; PackageReference: SOD-123-2-425-04; ComponentLink3URL: http://www.onsemi.com/pub_link/Collateral/425-04.PDF; Mounting Technology: Surface Mount; ComponentLink2Description: Datasheet; ComponentLink1URL: http://www.onsemi.com/; ComponentLink3Description: Package Specification; PackageDescription: 2-Pin SOD, Body 1.6 x 2.69 mm; PackageVersion: Rev. G, 10/2009; ComponentLink1Description: Manufacturer URL; RoHS: Pb-Free; ComponentLink2URL: http://www.onsemi.com/pub_link/Collateral/MMSZ5221BT1-D.PDF; Packing: Tape and Reel; DatasheetVersion: Rev. 12
D2-D7 = CMP-04989-000002-1: 4-CHANNEL LOW-CAPACITANCE SURGE; Manufacturer: Texas Instruments; Value: 0.55pF; Reverse Standoff Voltage: 3.6V; Standoff Height: 0mm; Breakdown Voltage: 5.5V; Peak Pulse Current: 5.5A; Clamping Voltage: 11.5V; Direction: Bidirectional; Peak Pulse Power: 50W; Number Of Channels: 4; Ambient Temperature Range High: +125°C; ComponentLink2Description: Datasheet; Height: 0.55mm; Lead Free: Yes; Device Class L3: unset; Temperature Range High: +125°C; Temperature Range Low: -40°C; Package: DQA0010A; Temperature: -40°C to +125°C; Capacitance: 0.55pF; RoHS: TRUE; Mouser Description: 4-Channel Low-Capacitance Surge and ESD Protection Diode 10-USON -40 to 125; Category: Diode; Device Class L1: Circuit Protection; Octopart: https://octopart.com/esd204dqar-texas+instruments-89917476; Device Class L2: TVS Diodes; Ambient Temperature Range Low: -40°C; Manufacturer Part Number: ESD204DQAR; ComponentLink2URL: http://www.ti.com/lit/ds/symlink/esd204.pdf; Automotive: No; Digikey Description: 4-CHANNEL LOW-CAPACITANCE SURGE
D10 = CMP-004-00040-2: Led, Red/Grn, 180Mcd/230Mcd, 624Nm/525Nm Rohs Compliant: Yes; Source: rgled.SchLib; Component Type: Standard; Design Item ID: CMP-004-00034-2; Pins: 4
F1 = CMP-07399-000013-1: FUSE BOARD MOUNT 2A 63VDC 1206; Voltage Rating (DC): 63V; Fuse Type: Board Mount (Cartridge Style Excluded); Approvals: UL; Mount: Surface Mount; Min Operating Temperature: -20°C; Max Operating Temperature: 105°C; Case Code (Imperial): 1206; Packaging: Cut Tape; Current Rating: 2A; RoHS Compliant: Yes; Series: SinglFuse™ SF-1206FP; Case Code (Metric): 3216; Case/Package: 1206
J1 = CMP-002-00067-1: Barrier Strip Terminal Block; RoHS Compliant: Yes
J2 = CMP-12637-106234071-1: PJ-102A 2.0 x 6.5 mm, 2.5 A, Horizontal, Through Hole, Tapered Pins, Dc Power Jack Connector; Voltage Rating (DC): 24V; Number of Contacts: 3; Outside Diameter: 6.5mm; Gender: Male; Shielding: No; Insulation Resistance: 50MΩ; Current Rating: 2.5A; Inside Diameter: 2mm; Number of Conductors: 2; Housing Color: Black; RoHS: Compliant; Diameter: 2.1mm; Mount: Through Hole; Contact Plating: Nickel; NexarPartId: 106234071; Voltage Rating: 24V; Housing Material: Thermoplastic; Max Operating Temperature: 85°C; Color: Black; Contact Material: Copper, Nickel, Tin; Orientation: Horizontal; Packaging: Bulk; Flammability Rating: UL94 V-0; Schedule B: 8536695050, 8536695050; Contact Gender: Male; Lead Free: Lead Free; Termination: Through Hole; Min Operating Temperature: -25°C; Height: 11.2mm; Lifecycle Status: Production
J3 = CMP-002-00090-1: Connector RJ45 Receptacle 8 Position Solder Straight Through Hole 1 Port Tray; Pins: 8; Max Operating Temperature: 70°C; Min Operating Temperature: 0°C
J4-J7 = CMP-002-00103-2: RF Connector, 2 Contact(s), Male, Panel Mount, Board And Panel Mount, Solder Terminal, Plug; Pins: 2; Min Operating Temperature: -40°C; Max Operating Temperature: 105°C
J10-J19 = CMP-2000-05181-2: PC TEST POINT MINIATURE BLACK; Body Material: Bronze; Plating: Silver; Inside Diameter: 1.27mm; Hole Diameter: 1.6mm; Number of Ports: 1; Outside Diameter: 2.54mm; Insulation: Insulated; Insulation Material: Nylon; Mount: Through Hole; RoHS Compliant: Yes; Series: THM; Height: 0.3inch; Termination: Through Hole; Material: Nylon; Packaging: Bulk; Contact Material: Bronze; REACH SVHC: No SVHC; Contact Plating: Silver; Orientation: Straight; Lead Free: Lead Free; Package Quantity: 100; Length: 7.62mm; Flammability Rating: UL94 V-0; Number of Contacts: 1; Diameter: 2.54mm; Housing Color: Black; Color: Black
MH1-MH8 = CMP-00028-00001-13: Plated mounting hole with 6 peripheral vias. This is a generic symbol that groups all relevant footprints.
Q1 = CMP-013-00018-2: Trans MOSFET P-CH 20V 22.1A 8-Pin PowerPAK 1212 EP T/R; Source: SISH615ADN-T1-GE3.SchLib; Design Item ID: CMP-013-00036-4; Component Type: Standard; Pins: 5
R1-R3 R50 R51 = CMP-009-00002-14: Resistor
  R1: Value: 100k
  R2 R3 R50 R51: Value: 1k
R38 R40 R55-R76 = CMP-009-00118-2: READ THE NAME; Pins: 2; Component Type: Standard; Design Item ID: CMP-009-00206-2; Source: 0402jump.SchLib

## Sheet SJA1105Q_PINOUT.SchDoc
size D; SheetNumber: 2; SheetTotal: 7
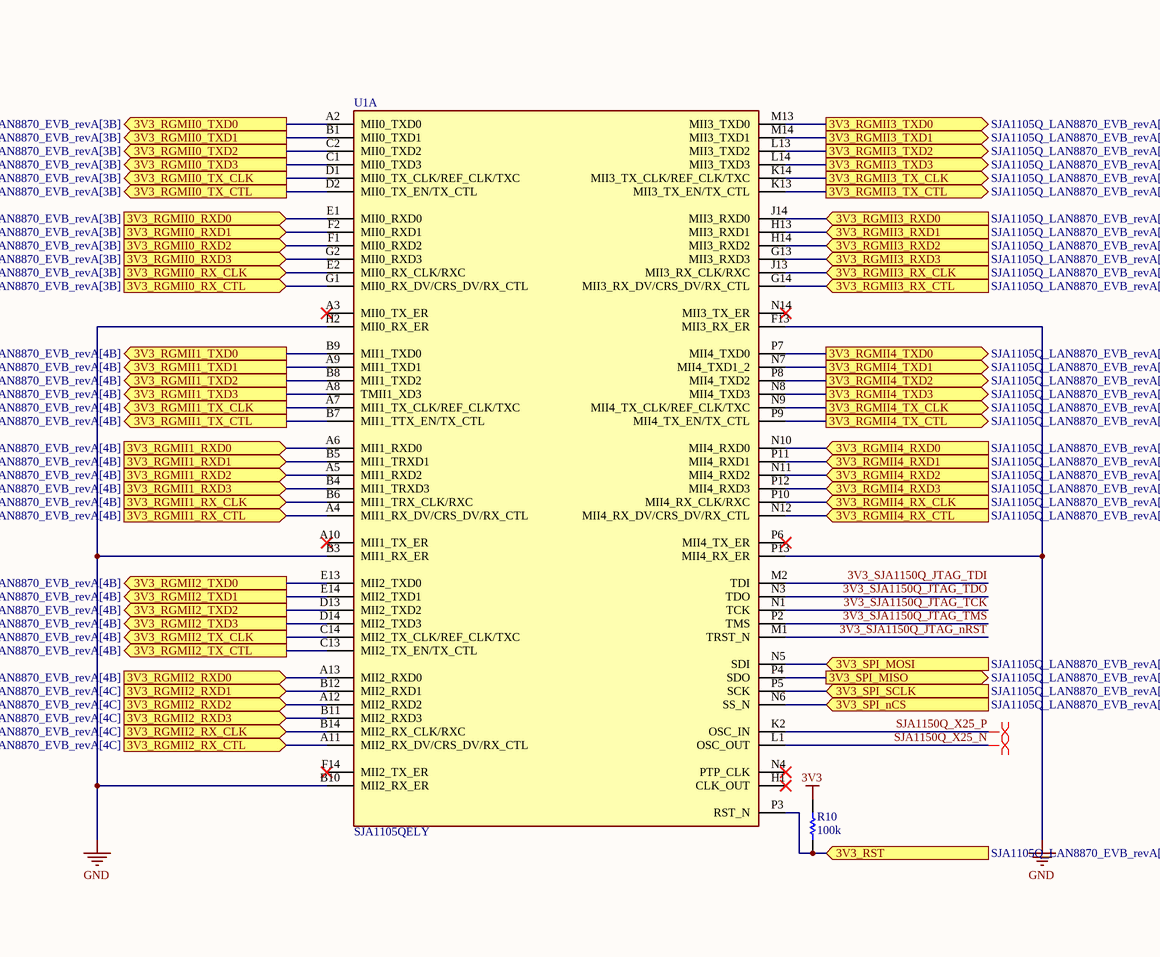
[diagram p4: SJA1105Q_PINOUT.SchDoc, top left]
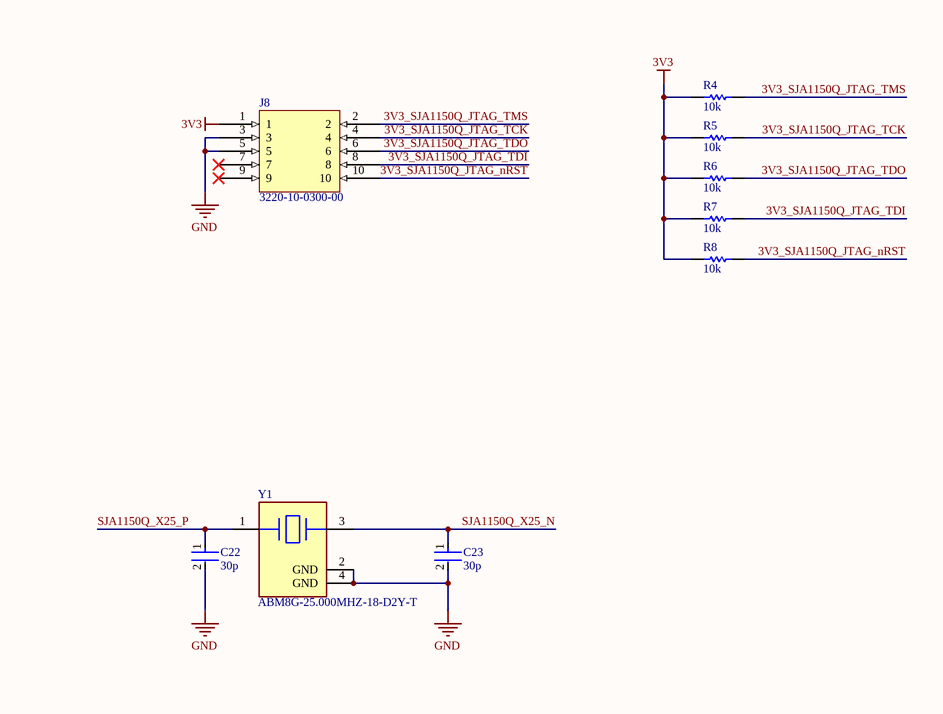
[diagram p5: SJA1105Q_PINOUT.SchDoc, top right]
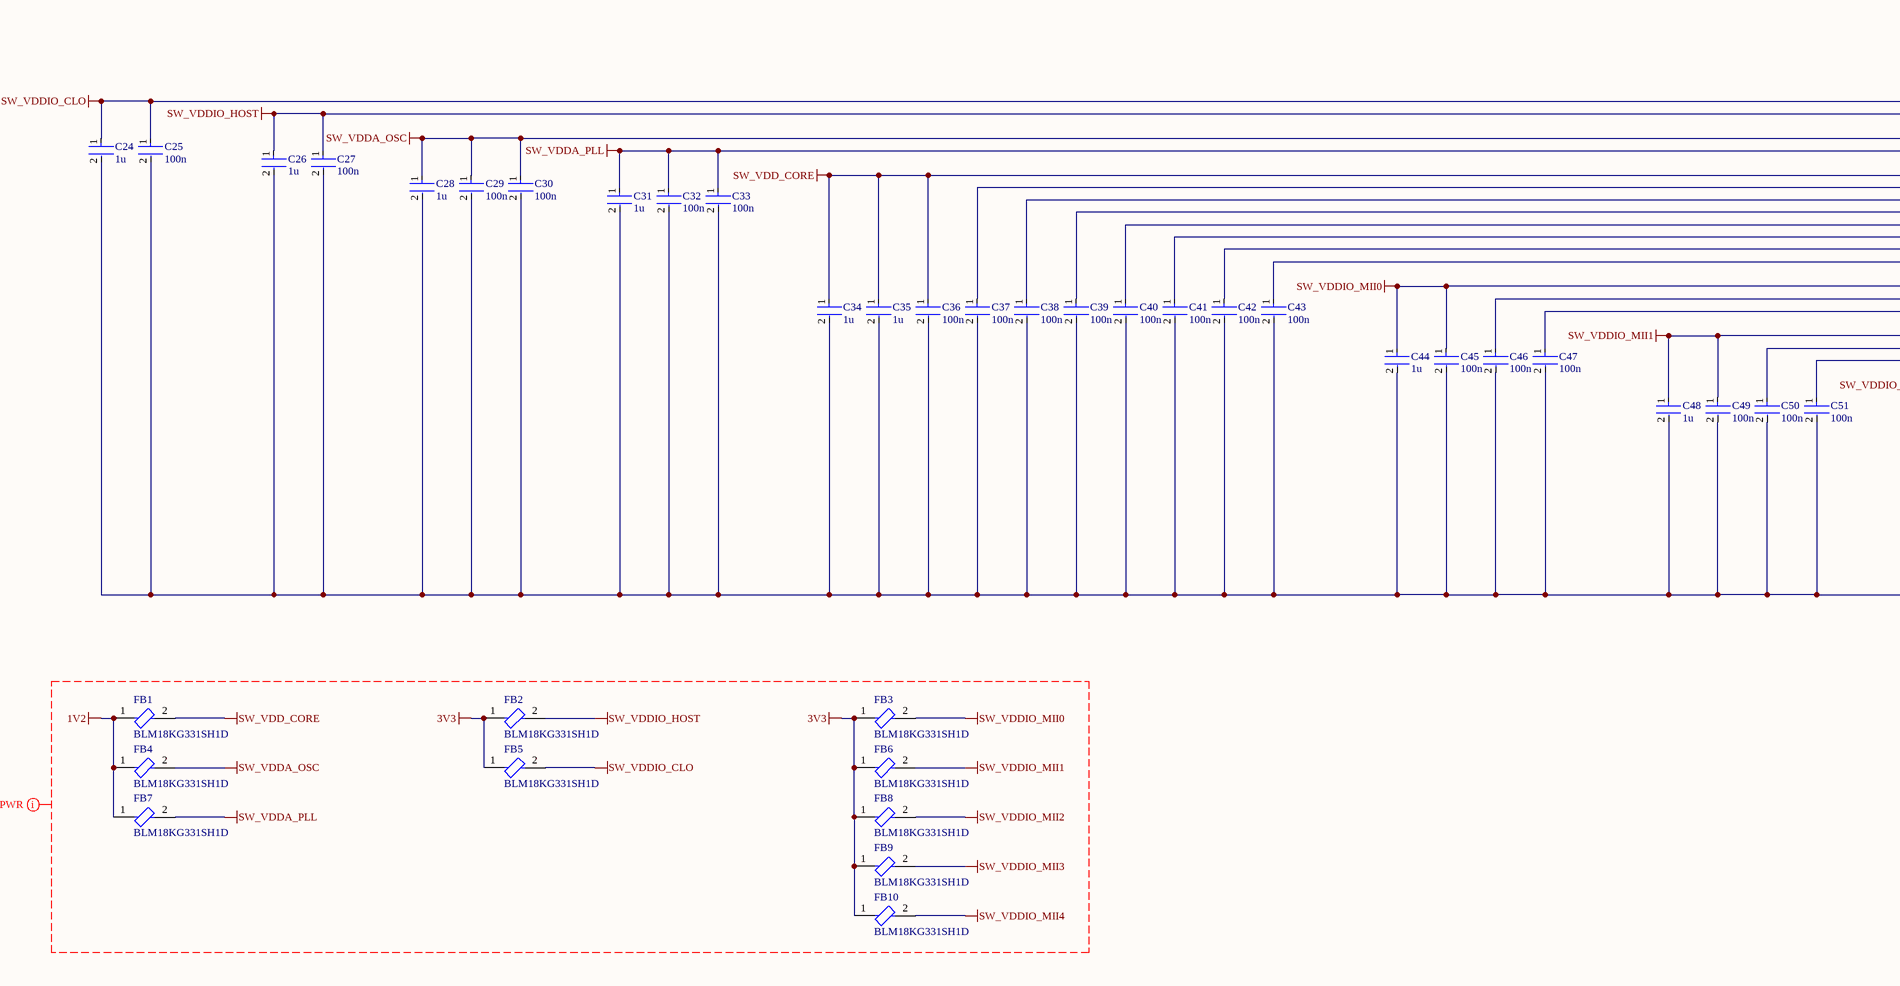
[diagram p6: SJA1105Q_PINOUT.SchDoc, bottom left]
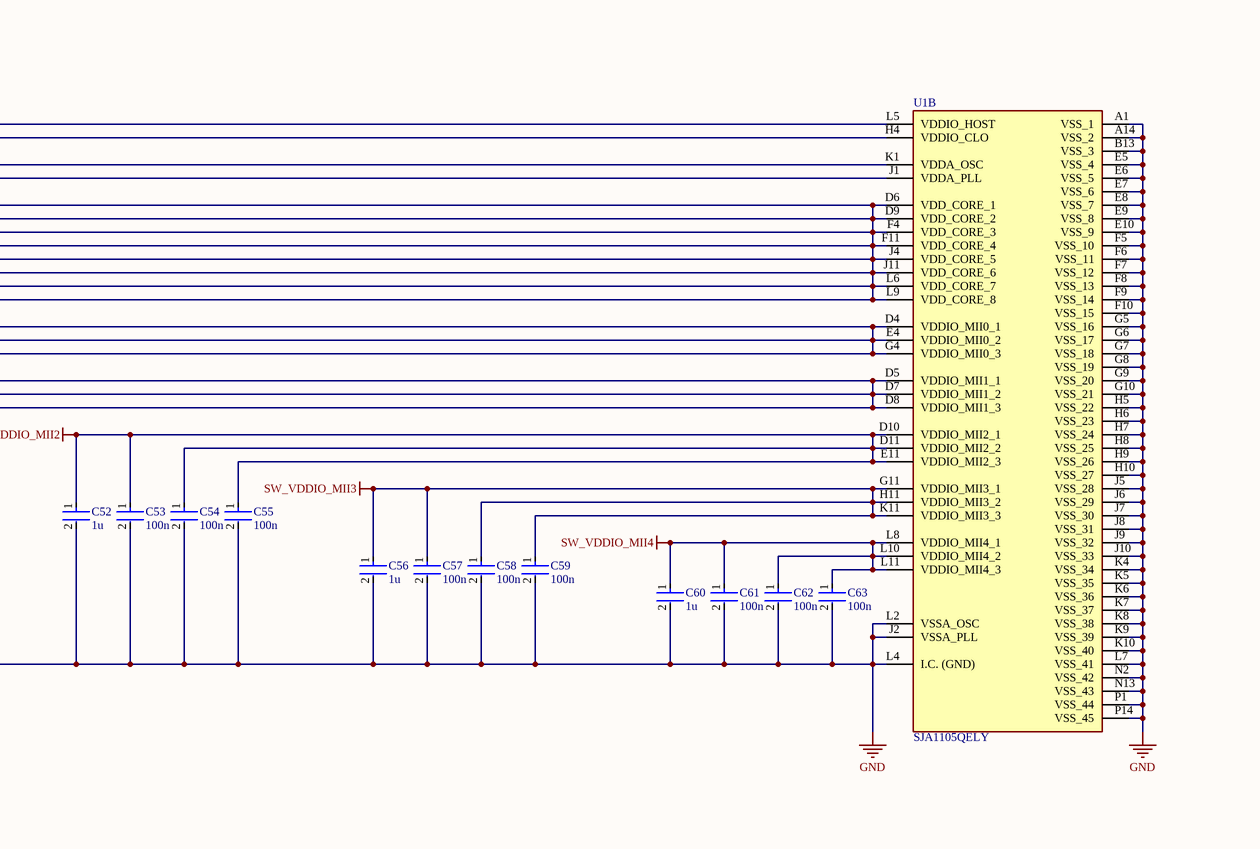
[diagram p7: SJA1105Q_PINOUT.SchDoc, bottom right]

### Parts
C22  30p  [FP-0402-L_1_0_0_05-W_0_5-IPC_A]
C23  30p  [FP-0402-L_1_0_0_05-W_0_5-IPC_A]
C24  1u  [FP-0402-L_1_0_0_05-W_0_5-IPC_A]
C25  100n  [FP-0402-L_1_0_0_05-W_0_5-IPC_A]
C26  1u  [FP-0402-L_1_0_0_05-W_0_5-IPC_A]
C27  100n  [FP-0402-L_1_0_0_05-W_0_5-IPC_A]
C28  1u  [FP-0402-L_1_0_0_05-W_0_5-IPC_A]
C29  100n  [FP-0402-L_1_0_0_05-W_0_5-IPC_A]
C30  100n  [FP-0402-L_1_0_0_05-W_0_5-IPC_A]
C31  1u  [FP-0402-L_1_0_0_05-W_0_5-IPC_A]
C32  100n  [FP-0402-L_1_0_0_05-W_0_5-IPC_A]
C33  100n  [FP-0402-L_1_0_0_05-W_0_5-IPC_A]
C34  1u  [FP-0402-L_1_0_0_05-W_0_5-IPC_A]
C35  1u  [FP-0402-L_1_0_0_05-W_0_5-IPC_A]
C36  100n  [FP-0402-L_1_0_0_05-W_0_5-IPC_A]
C37  100n  [FP-0402-L_1_0_0_05-W_0_5-IPC_A]
C38  100n  [FP-0402-L_1_0_0_05-W_0_5-IPC_A]
C39  100n  [FP-0402-L_1_0_0_05-W_0_5-IPC_A]
C40  100n  [FP-0402-L_1_0_0_05-W_0_5-IPC_A]
C41  100n  [FP-0402-L_1_0_0_05-W_0_5-IPC_A]
C42  100n  [FP-0402-L_1_0_0_05-W_0_5-IPC_A]
C43  100n  [FP-0402-L_1_0_0_05-W_0_5-IPC_A]
C44  1u  [FP-0402-L_1_0_0_05-W_0_5-IPC_A]
C45  100n  [FP-0402-L_1_0_0_05-W_0_5-IPC_A]
C46  100n  [FP-0402-L_1_0_0_05-W_0_5-IPC_A]
C47  100n  [FP-0402-L_1_0_0_05-W_0_5-IPC_A]
C48  1u  [FP-0402-L_1_0_0_05-W_0_5-IPC_A]
C49  100n  [FP-0402-L_1_0_0_05-W_0_5-IPC_A]
C50  100n  [FP-0402-L_1_0_0_05-W_0_5-IPC_A]
C51  100n  [FP-0402-L_1_0_0_05-W_0_5-IPC_A]
C52  1u  [FP-0402-L_1_0_0_05-W_0_5-IPC_A]
C53  100n  [FP-0402-L_1_0_0_05-W_0_5-IPC_A]
C54  100n  [FP-0402-L_1_0_0_05-W_0_5-IPC_A]
C55  100n  [FP-0402-L_1_0_0_05-W_0_5-IPC_A]
C56  1u  [FP-0402-L_1_0_0_05-W_0_5-IPC_A]
C57  100n  [FP-0402-L_1_0_0_05-W_0_5-IPC_A]
C58  100n  [FP-0402-L_1_0_0_05-W_0_5-IPC_A]
C59  100n  [FP-0402-L_1_0_0_05-W_0_5-IPC_A]
C60  1u  [FP-0402-L_1_0_0_05-W_0_5-IPC_A]
C61  100n  [FP-0402-L_1_0_0_05-W_0_5-IPC_A]
C62  100n  [FP-0402-L_1_0_0_05-W_0_5-IPC_A]
C63  100n  [FP-0402-L_1_0_0_05-W_0_5-IPC_A]
FB1  BLM18KG331SH1D  [FP-BLM18-0_15-t0_8-IPC_B]
FB2  BLM18KG331SH1D  [FP-BLM18-0_15-t0_8-IPC_B]
FB3  BLM18KG331SH1D  [FP-BLM18-0_15-t0_8-IPC_B]
FB4  BLM18KG331SH1D  [FP-BLM18-0_15-t0_8-IPC_B]
FB5  BLM18KG331SH1D  [FP-BLM18-0_15-t0_8-IPC_B]
FB6  BLM18KG331SH1D  [FP-BLM18-0_15-t0_8-IPC_B]
FB7  BLM18KG331SH1D  [FP-BLM18-0_15-t0_8-IPC_B]
FB8  BLM18KG331SH1D  [FP-BLM18-0_15-t0_8-IPC_B]
FB9  BLM18KG331SH1D  [FP-BLM18-0_15-t0_8-IPC_B]
FB10  BLM18KG331SH1D  [FP-BLM18-0_15-t0_8-IPC_B]
J8  3220-10-0300-00  [3220-10-0300-00-Footprint-1]
R4  10k  [R0603B]
R5  10k  [R0603B]
R6  10k  [R0603B]
R7  10k  [R0603B]
R8  10k  [R0603B]
R10  100k  [R0603B]
U1  SJA1105QELY  [SJA1105QELY-Footprint-1]  (parts A,B of 2)
Y1  ABM8G-25.000MHZ-18-D2Y-T  [FP-ABM8G-MFG]

### Ports
3V3_RGMII0_RX_CLK (in, see SJA1105Q_LAN8870_EVB_revA[3B]), 3V3_RGMII0_RX_CTL (in, see SJA1105Q_LAN8870_EVB_revA[3B]), 3V3_RGMII0_RXD0 (in, see SJA1105Q_LAN8870_EVB_revA[3B]), 3V3_RGMII0_RXD1 (in, see SJA1105Q_LAN8870_EVB_revA[3B]), 3V3_RGMII0_RXD2 (in, see SJA1105Q_LAN8870_EVB_revA[3B]), 3V3_RGMII0_RXD3 (in, see SJA1105Q_LAN8870_EVB_revA[3B]), 3V3_RGMII0_TX_CLK (out, see SJA1105Q_LAN8870_EVB_revA[3B]), 3V3_RGMII0_TX_CTL (out, see SJA1105Q_LAN8870_EVB_revA[3B]), 3V3_RGMII0_TXD0 (out, see SJA1105Q_LAN8870_EVB_revA[3B]), 3V3_RGMII0_TXD1 (out, see SJA1105Q_LAN8870_EVB_revA[3B]), 3V3_RGMII0_TXD2 (out, see SJA1105Q_LAN8870_EVB_revA[3B]), 3V3_RGMII0_TXD3 (out, see SJA1105Q_LAN8870_EVB_revA[3B]), 3V3_RGMII1_RX_CLK (in, see SJA1105Q_LAN8870_EVB_revA[4B]), 3V3_RGMII1_RX_CTL (in, see SJA1105Q_LAN8870_EVB_revA[4B]), 3V3_RGMII1_RXD0 (in, see SJA1105Q_LAN8870_EVB_revA[4B]), 3V3_RGMII1_RXD1 (in, see SJA1105Q_LAN8870_EVB_revA[4B]), 3V3_RGMII1_RXD2 (in, see SJA1105Q_LAN8870_EVB_revA[4B]), 3V3_RGMII1_RXD3 (in, see SJA1105Q_LAN8870_EVB_revA[4B]), 3V3_RGMII1_TX_CLK (out, see SJA1105Q_LAN8870_EVB_revA[4B]), 3V3_RGMII1_TX_CTL (out, see SJA1105Q_LAN8870_EVB_revA[4B]), 3V3_RGMII1_TXD0 (out, see SJA1105Q_LAN8870_EVB_revA[4B]), 3V3_RGMII1_TXD1 (out, see SJA1105Q_LAN8870_EVB_revA[4B]), 3V3_RGMII1_TXD2 (out, see SJA1105Q_LAN8870_EVB_revA[4B]), 3V3_RGMII1_TXD3 (out, see SJA1105Q_LAN8870_EVB_revA[4B]), 3V3_RGMII2_RX_CLK (in, see SJA1105Q_LAN8870_EVB_revA[4C]), 3V3_RGMII2_RX_CTL (in, see SJA1105Q_LAN8870_EVB_revA[4C]), 3V3_RGMII2_RXD0 (in, see SJA1105Q_LAN8870_EVB_revA[4B]), 3V3_RGMII2_RXD1 (in, see SJA1105Q_LAN8870_EVB_revA[4C]), 3V3_RGMII2_RXD2 (in, see SJA1105Q_LAN8870_EVB_revA[4C]), 3V3_RGMII2_RXD3 (in, see SJA1105Q_LAN8870_EVB_revA[4C]), 3V3_RGMII2_TX_CLK (out, see SJA1105Q_LAN8870_EVB_revA[4B]), 3V3_RGMII2_TX_CTL (out, see SJA1105Q_LAN8870_EVB_revA[4B]), 3V3_RGMII2_TXD0 (out, see SJA1105Q_LAN8870_EVB_revA[4B]), 3V3_RGMII2_TXD1 (out, see SJA1105Q_LAN8870_EVB_revA[4B]), 3V3_RGMII2_TXD2 (out, see SJA1105Q_LAN8870_EVB_revA[4B]), 3V3_RGMII2_TXD3 (out, see SJA1105Q_LAN8870_EVB_revA[4B]), 3V3_RGMII3_RX_CLK (in, see SJA1105Q_LAN8870_EVB_revA[4C]), 3V3_RGMII3_RX_CTL (in, see SJA1105Q_LAN8870_EVB_revA[4C]), 3V3_RGMII3_RXD0 (in, see SJA1105Q_LAN8870_EVB_revA[4C]), 3V3_RGMII3_RXD1 (in, see SJA1105Q_LAN8870_EVB_revA[4C]), 3V3_RGMII3_RXD2 (in, see SJA1105Q_LAN8870_EVB_revA[4C]), 3V3_RGMII3_RXD3 (in, see SJA1105Q_LAN8870_EVB_revA[4C]), 3V3_RGMII3_TX_CLK (out, see SJA1105Q_LAN8870_EVB_revA[4C]), 3V3_RGMII3_TX_CTL (out, see SJA1105Q_LAN8870_EVB_revA[4C]), 3V3_RGMII3_TXD0 (out, see SJA1105Q_LAN8870_EVB_revA[4C]), 3V3_RGMII3_TXD1 (out, see SJA1105Q_LAN8870_EVB_revA[4C]), 3V3_RGMII3_TXD2 (out, see SJA1105Q_LAN8870_EVB_revA[4C]), 3V3_RGMII3_TXD3 (out, see SJA1105Q_LAN8870_EVB_revA[4C]), 3V3_RGMII4_RX_CLK (in, see SJA1105Q_LAN8870_EVB_revA[4C]), 3V3_RGMII4_RX_CTL (in, see SJA1105Q_LAN8870_EVB_revA[4C]), 3V3_RGMII4_RXD0 (in, see SJA1105Q_LAN8870_EVB_revA[4C]), 3V3_RGMII4_RXD1 (in, see SJA1105Q_LAN8870_EVB_revA[4C]), 3V3_RGMII4_RXD2 (in, see SJA1105Q_LAN8870_EVB_revA[4C]), 3V3_RGMII4_RXD3 (in, see SJA1105Q_LAN8870_EVB_revA[4C]), 3V3_RGMII4_TX_CLK (out, see SJA1105Q_LAN8870_EVB_revA[4C]), 3V3_RGMII4_TX_CTL (out, see SJA1105Q_LAN8870_EVB_revA[4C]), 3V3_RGMII4_TXD0 (out, see SJA1105Q_LAN8870_EVB_revA[4C]), 3V3_RGMII4_TXD1 (out, see SJA1105Q_LAN8870_EVB_revA[4C]), 3V3_RGMII4_TXD2 (out, see SJA1105Q_LAN8870_EVB_revA[4C]), 3V3_RGMII4_TXD3 (out, see SJA1105Q_LAN8870_EVB_revA[4C]), 3V3_RST (in, see SJA1105Q_LAN8870_EVB_revA[3C]), 3V3_SPI_MISO (out, see SJA1105Q_LAN8870_EVB_revA[3C]), 3V3_SPI_MOSI (in, see SJA1105Q_LAN8870_EVB_revA[3C]), 3V3_SPI_nCS (in, see SJA1105Q_LAN8870_EVB_revA[3C]), 3V3_SPI_SCLK (in, see SJA1105Q_LAN8870_EVB_revA[3C])

### Nets
1V2: FB1.1 FB4.1 FB7.1
3V3: FB2.1 FB3.1 FB5.1 FB6.1 FB8.1 FB9.1 FB10.1 J8.1 R4.1 R5.1 R6.1 R7.2 R8.1 R10.2
GND: C22.2 C23.2 C24.2 C25.2 C26.2 C27.2 C28.2 C29.2 C30.2 C31.2 C32.2 C33.2 C34.2 C35.2 C36.2 C37.2 C38.2 C39.2 C40.2 C41.2 C42.2 C43.2 C44.2 C45.2 C46.2 C47.2 C48.2 C49.2 C50.2 C51.2 C52.2 C53.2 C54.2 C55.2 C56.2 C57.2 C58.2 C59.2 C60.2 C61.2 C62.2 C63.2 J8.3 J8.5 U1.A1(VSS_1) U1.A14(VSS_2) U1.B3(MII1_RX_ER) U1.B10(MII2_RX_ER) U1.B13(VSS_3) U1.E5(VSS_4) U1.E6(VSS_5) U1.E7(VSS_6) U1.E8(VSS_7) U1.E9(VSS_8) U1.E10(VSS_9) U1.F5(VSS_10) U1.F6(VSS_11) U1.F7(VSS_12) U1.F8(VSS_13) U1.F9(VSS_14) U1.F10(VSS_15) U1.F13(MII3_RX_ER) U1.G5(VSS_16) U1.G6(VSS_17) U1.G7(VSS_18) U1.G8(VSS_19) U1.G9(VSS_20) U1.G10(VSS_21) U1.H2(MII0_RX_ER) U1.H5(VSS_22) U1.H6(VSS_23) U1.H7(VSS_24) U1.H8(VSS_25) U1.H9(VSS_26) U1.H10(VSS_27) U1.J2(VSSA_PLL) U1.J5(VSS_28) U1.J6(VSS_29) U1.J7(VSS_30) U1.J8(VSS_31) U1.J9(VSS_32) U1.J10(VSS_33) U1.K4(VSS_34) U1.K5(VSS_35) U1.K6(VSS_36) U1.K7(VSS_37) U1.K8(VSS_38) U1.K9(VSS_39) U1.K10(VSS_40) U1.L2(VSSA_OSC) U1.L4(I.C._(GND)) U1.L7(VSS_41) U1.N2(VSS_42) U1.N13(VSS_43) U1.P1(VSS_44) U1.P13(MII4_RX_ER) U1.P14(VSS_45) Y1.2(GND) Y1.4(GND)
SW_VDD_CORE: C34.1 C35.1 C36.1 C37.1 C38.1 C39.1 C40.1 C41.1 C42.1 C43.1 FB1.2 U1.D6(VDD_CORE_1) U1.D9(VDD_CORE_2) U1.F4(VDD_CORE_3) U1.F11(VDD_CORE_4) U1.J4(VDD_CORE_5) U1.J11(VDD_CORE_6) U1.L6(VDD_CORE_7) U1.L9(VDD_CORE_8)
SW_VDDA_OSC: C28.1 C29.1 C30.1 FB4.2 U1.K1(VDDA_OSC)
SW_VDDA_PLL: C31.1 C32.1 C33.1 FB7.2 U1.J1(VDDA_PLL)
SW_VDDIO_CLO: C24.1 C25.1 FB5.2 U1.L5(VDDIO_HOST)
SW_VDDIO_HOST: C26.1 C27.1 FB2.2 U1.H4(VDDIO_CLO)
SW_VDDIO_MII0: C44.1 C45.1 C46.1 C47.1 FB3.2 U1.D4(VDDIO_MII0_1) U1.E4(VDDIO_MII0_2) U1.G4(VDDIO_MII0_3)
SW_VDDIO_MII1: C48.1 C49.1 C50.1 C51.1 FB6.2 U1.D5(VDDIO_MII1_1) U1.D7(VDDIO_MII1_2) U1.D8(VDDIO_MII1_3)
SW_VDDIO_MII2: C52.1 C53.1 C54.1 C55.1 FB8.2 U1.D10(VDDIO_MII2_1) U1.D11(VDDIO_MII2_2) U1.E11(VDDIO_MII2_3)
SW_VDDIO_MII3: C56.1 C57.1 C58.1 C59.1 FB9.2 U1.G11(VDDIO_MII3_1) U1.H11(VDDIO_MII3_2) U1.K11(VDDIO_MII3_3)
SW_VDDIO_MII4: C60.1 C61.1 C62.1 C63.1 FB10.2 U1.L8(VDDIO_MII4_1) U1.L10(VDDIO_MII4_2) U1.L11(VDDIO_MII4_3)
3V3_SJA1150Q_JTAG_nRST: J8.10 R8.2 U1.M1(TRST_N)
3V3_SJA1150Q_JTAG_TCK: J8.4 R5.2 U1.N1(TCK)
3V3_SJA1150Q_JTAG_TDI: J8.8 R7.1 U1.M2(TDI)
3V3_SJA1150Q_JTAG_TDO: J8.6 R6.2 U1.N3(TDO)
3V3_SJA1150Q_JTAG_TMS: J8.2 R4.2 U1.P2(TMS)
3V3_SJA1150Q_MISO: U1.P4(SDO) ; port 3V3_SPI_MISO
3V3_SJA1150Q_MOSI: U1.N5(SDI) ; port 3V3_SPI_MOSI
3V3_SJA1150Q_nCS: U1.N6(SS_N) ; port 3V3_SPI_nCS
3V3_SJA1150Q_nRST: R10.1 U1.P3(RST_N) ; port 3V3_RST
3V3_SJA1150Q_SCLK: U1.P5(SCK) ; port 3V3_SPI_SCLK
LAN8870_RX_CLK: U1.B6(MII1_TRX_CLK/RXC) ; port 3V3_RGMII1_RX_CLK
LAN8870_RX_CLK: U1.B14(MII2_RX_CLK/RXC) ; port 3V3_RGMII2_RX_CLK  [a separate net that carries the same name]
LAN8870_RX_CLK: U1.J13(MII3_RX_CLK/RXC) ; port 3V3_RGMII3_RX_CLK  [a separate net that carries the same name]
LAN8870_RXCTL: U1.A4(MII1_RX_DV/CRS_DV/RX_CTL) ; port 3V3_RGMII1_RX_CTL
LAN8870_RXCTL: U1.A11(MII2_RX_DV/CRS_DV/RX_CTL) ; port 3V3_RGMII2_RX_CTL  [a separate net that carries the same name]
LAN8870_RXCTL: U1.G14(MII3_RX_DV/CRS_DV/RX_CTL) ; port 3V3_RGMII3_RX_CTL  [a separate net that carries the same name]
LAN8870_RXD0: U1.A6(MII1_RXD0) ; port 3V3_RGMII1_RXD0
LAN8870_RXD0: U1.A13(MII2_RXD0) ; port 3V3_RGMII2_RXD0  [a separate net that carries the same name]
LAN8870_RXD0: U1.J14(MII3_RXD0) ; port 3V3_RGMII3_RXD0  [a separate net that carries the same name]
LAN8870_RXD1: U1.B5(MII1_TRXD1) ; port 3V3_RGMII1_RXD1
LAN8870_RXD1: U1.B12(MII2_RXD1) ; port 3V3_RGMII2_RXD1  [a separate net that carries the same name]
LAN8870_RXD1: U1.H13(MII3_RXD1) ; port 3V3_RGMII3_RXD1  [a separate net that carries the same name]
LAN8870_RXD2: U1.A5(MII1_RXD2) ; port 3V3_RGMII1_RXD2
LAN8870_RXD2: U1.A12(MII2_RXD2) ; port 3V3_RGMII2_RXD2  [a separate net that carries the same name]
LAN8870_RXD2: U1.H14(MII3_RXD2) ; port 3V3_RGMII3_RXD2  [a separate net that carries the same name]
LAN8870_RXD3: U1.B4(MII1_TRXD3) ; port 3V3_RGMII1_RXD3
LAN8870_RXD3: U1.B11(MII2_RXD3) ; port 3V3_RGMII2_RXD3  [a separate net that carries the same name]
LAN8870_RXD3: U1.G13(MII3_RXD3) ; port 3V3_RGMII3_RXD3  [a separate net that carries the same name]
LAN8870_TX_CLK: U1.A7(MII1_TX_CLK/REF_CLK/TXC) ; port 3V3_RGMII1_TX_CLK
LAN8870_TX_CLK: U1.C14(MII2_TX_CLK/REF_CLK/TXC) ; port 3V3_RGMII2_TX_CLK  [a separate net that carries the same name]
LAN8870_TX_CLK: U1.K14(MII3_TX_CLK/REF_CLK/TXC) ; port 3V3_RGMII3_TX_CLK  [a separate net that carries the same name]
LAN8870_TX_CTL: U1.B7(MII1_TTX_EN/TX_CTL) ; port 3V3_RGMII1_TX_CTL
LAN8870_TX_CTL: U1.C13(MII2_TX_EN/TX_CTL) ; port 3V3_RGMII2_TX_CTL  [a separate net that carries the same name]
LAN8870_TX_CTL: U1.K13(MII3_TX_EN/TX_CTL) ; port 3V3_RGMII3_TX_CTL  [a separate net that carries the same name]
LAN8870_TXD0: U1.B9(MII1_TXD0) ; port 3V3_RGMII1_TXD0
LAN8870_TXD0: U1.E13(MII2_TXD0) ; port 3V3_RGMII2_TXD0  [a separate net that carries the same name]
LAN8870_TXD0: U1.M13(MII3_TXD0) ; port 3V3_RGMII3_TXD0  [a separate net that carries the same name]
LAN8870_TXD1: U1.A9(MII1_TXD1) ; port 3V3_RGMII1_TXD1
LAN8870_TXD1: U1.E14(MII2_TXD1) ; port 3V3_RGMII2_TXD1  [a separate net that carries the same name]
LAN8870_TXD1: U1.M14(MII3_TXD1) ; port 3V3_RGMII3_TXD1  [a separate net that carries the same name]
LAN8870_TXD2: U1.B8(MII1_TXD2) ; port 3V3_RGMII1_TXD2
LAN8870_TXD2: U1.D13(MII2_TXD2) ; port 3V3_RGMII2_TXD2  [a separate net that carries the same name]
LAN8870_TXD2: U1.L13(MII3_TXD2) ; port 3V3_RGMII3_TXD2  [a separate net that carries the same name]
LAN8870_TXD3: U1.A8(TMII1_XD3) ; port 3V3_RGMII1_TXD3
LAN8870_TXD3: U1.D14(MII2_TXD3) ; port 3V3_RGMII2_TXD3  [a separate net that carries the same name]
LAN8870_TXD3: U1.L14(MII3_TXD3) ; port 3V3_RGMII3_TXD3  [a separate net that carries the same name]
SJA1150Q_X25_N: C23.1 U1.L1(OSC_OUT) Y1.3
SJA1150Q_X25_P: C22.1 U1.K2(OSC_IN) Y1.1
NetR38_2: U1.A2(MII0_TXD0) ; port 3V3_RGMII0_TXD0
NetR40_2: U1.B1(MII0_TXD1) ; port 3V3_RGMII0_TXD1
NetR55_2: U1.C2(MII0_TXD2) ; port 3V3_RGMII0_TXD2
NetR56_2: U1.C1(MII0_TXD3) ; port 3V3_RGMII0_TXD3
NetR57_2: U1.D1(MII0_TX_CLK/REF_CLK/TXC) ; port 3V3_RGMII0_TX_CLK
NetR58_2: U1.D2(MII0_TX_EN/TX_CTL) ; port 3V3_RGMII0_TX_CTL
NetR59_2: U1.E1(MII0_RXD0) ; port 3V3_RGMII0_RXD0
NetR60_2: U1.F2(MII0_RXD1) ; port 3V3_RGMII0_RXD1
NetR61_2: U1.F1(MII0_RXD2) ; port 3V3_RGMII0_RXD2
NetR62_2: U1.G2(MII0_RXD3) ; port 3V3_RGMII0_RXD3
NetR63_2: U1.E2(MII0_RX_CLK/RXC) ; port 3V3_RGMII0_RX_CLK
NetR64_2: U1.G1(MII0_RX_DV/CRS_DV/RX_CTL) ; port 3V3_RGMII0_RX_CTL
NetR65_1: U1.P7(MII4_TXD0) ; port 3V3_RGMII4_TXD0
NetR66_1: U1.N7(MII4_TXD1_2) ; port 3V3_RGMII4_TXD1
NetR67_1: U1.P8(MII4_TXD2) ; port 3V3_RGMII4_TXD2
NetR68_1: U1.N8(MII4_TXD3) ; port 3V3_RGMII4_TXD3
NetR69_1: U1.N9(MII4_TX_CLK/REF_CLK/TXC) ; port 3V3_RGMII4_TX_CLK
NetR70_1: U1.P9(MII4_TX_EN/TX_CTL) ; port 3V3_RGMII4_TX_CTL
NetR71_1: U1.N10(MII4_RXD0) ; port 3V3_RGMII4_RXD0
NetR72_1: U1.P11(MII4_RXD1) ; port 3V3_RGMII4_RXD1
NetR73_1: U1.N11(MII4_RXD2) ; port 3V3_RGMII4_RXD2
NetR74_1: U1.P12(MII4_RXD3) ; port 3V3_RGMII4_RXD3
NetR75_1: U1.P10(MII4_RX_CLK/RXC) ; port 3V3_RGMII4_RX_CLK
NetR76_1: U1.N12(MII4_RX_DV/CRS_DV/RX_CTL) ; port 3V3_RGMII4_RX_CTL

Not connected (* = marked no-connect by the designer): J8 7* 9*; U1 A3(MII0_TX_ER)* A10(MII1_TX_ER)* F14(MII2_TX_ER)* H1(CLK_OUT)* N4(PTP_CLK)* N14(MII3_TX_ER)* P6(MII4_TX_ER)*

### Layout directives
differential pair: SJA1150Q_X25_N, SJA1150Q_X25_P
net class PWR: 1V2, 3V3, SW_VDD_CORE, SW_VDDA_OSC, SW_VDDA_PLL, SW_VDDIO_CLO, SW_VDDIO_HOST, SW_VDDIO_MII0, SW_VDDIO_MII1, SW_VDDIO_MII2, SW_VDDIO_MII3, SW_VDDIO_MII4

### Library data of the parts
C22-C63 = CMP-001-00058-1: as C1 on sheet SJA1105Q_LAN8870_EVB_revA; Min Operating Temperature: -55°C; Mounting Technology: Surface Mount; Pins: 2; Case/Package: 0402; RoHS Compliant: Yes; Max Operating Temperature: 85°C
FB1-FB10 = CMP-06046-002069-1: Chip Ferrite Bead, 0603, 330Ω @ 100MHz, 0.08Ω, 25%, 1.7A; Number of Lines: 1; DC Resistance (DCR): 80mR; Packaging: Tape and Reel; Case/Package: 0603; Height: 0.037inch; Case Code (Metric): 1608; Length: 0.063inch; Package Quantity: 4000; Max Operating Temperature: 125°C; Case Code (Imperial): 0603; RoHS Compliant: Yes; Width: 0.032inch; Mount: Surface Mount; Min Operating Temperature: -55°C; Ratings: AEC-Q200; Max Current Rating: 1.7A
J8 = CMP-001-0013-3: CONN HEADER SMD 10POS 1.27MM
R4-R8 R10 = CMP-009-00002-14: Resistor
  R4-R8: Value: 10k
  R10: Value: 100k
U1 = CMP-015-00025-2: Ethernet Controller, Ethernet Switch, IEEE 802.3, 1.2 V, LFBGA, 159 Pins; Min Operating Temperature: -40°C; Max Operating Temperature: 105°C
Y1 = CMP-2000-05733-3: Crystal 25MHz ±20ppm (Tol) ±30ppm (Stability) 18pF FUND 60Ω 4-Pin SMD T/R; Series Resistance: 60R; Length: 3.2mm; Depth: 2.5mm; Packaging: Tape and Reel; Min Operating Temperature: -40°C; Operating Frequency: 25 MHz; Lead Free: Lead Free; Number of Pins: 4; Frequency Tolerance: 20ppm; Radiation Hardening: No; Max Operating Temperature: 85°C; Termination: SMD/SMT; Frequency Stability: 30ppm; Frequency: 25MHz; Series: ABM8G; Mount: Surface Mount; Package Quantity: 1000; Height: 0.039inch; Width: 0.098inch; Case/Package: CSMD; ESR (Equivalent Series Resistance): 60R; Load Capacitance: 18pF; Tolerance: 20ppm